# EasyEDA Pro project ProPrj_T113最小系统(最简)_2026-08-06.epro, board PCB1
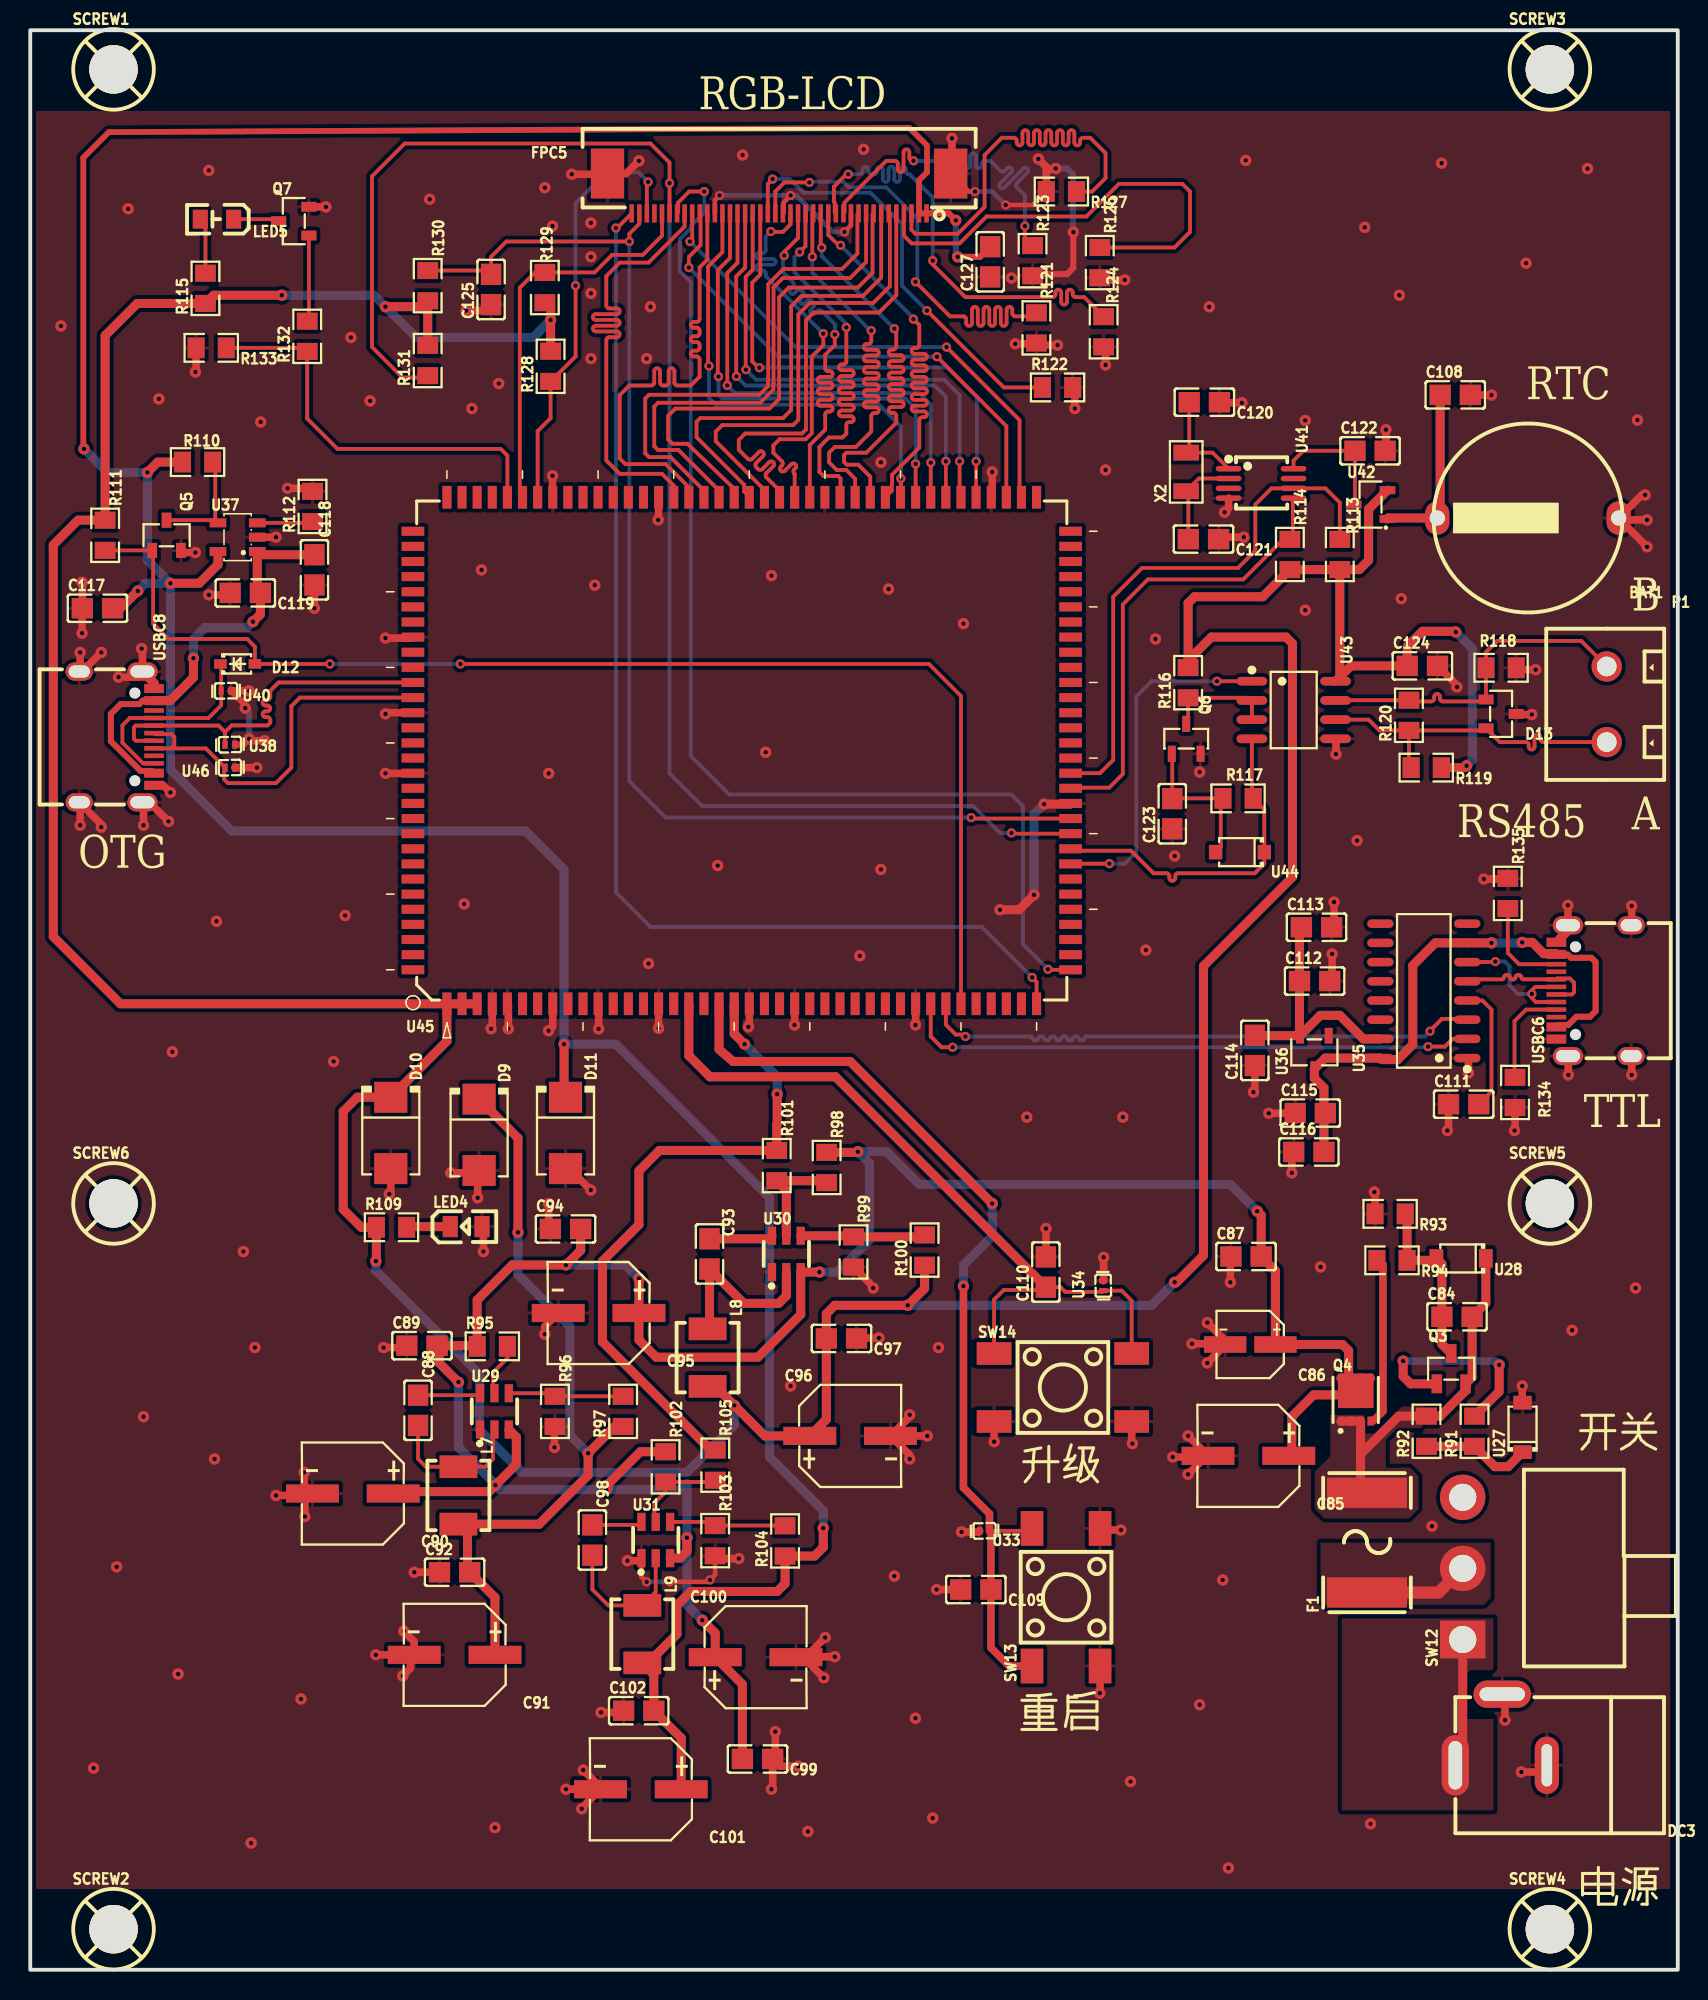
[diagram p3: board, top side]
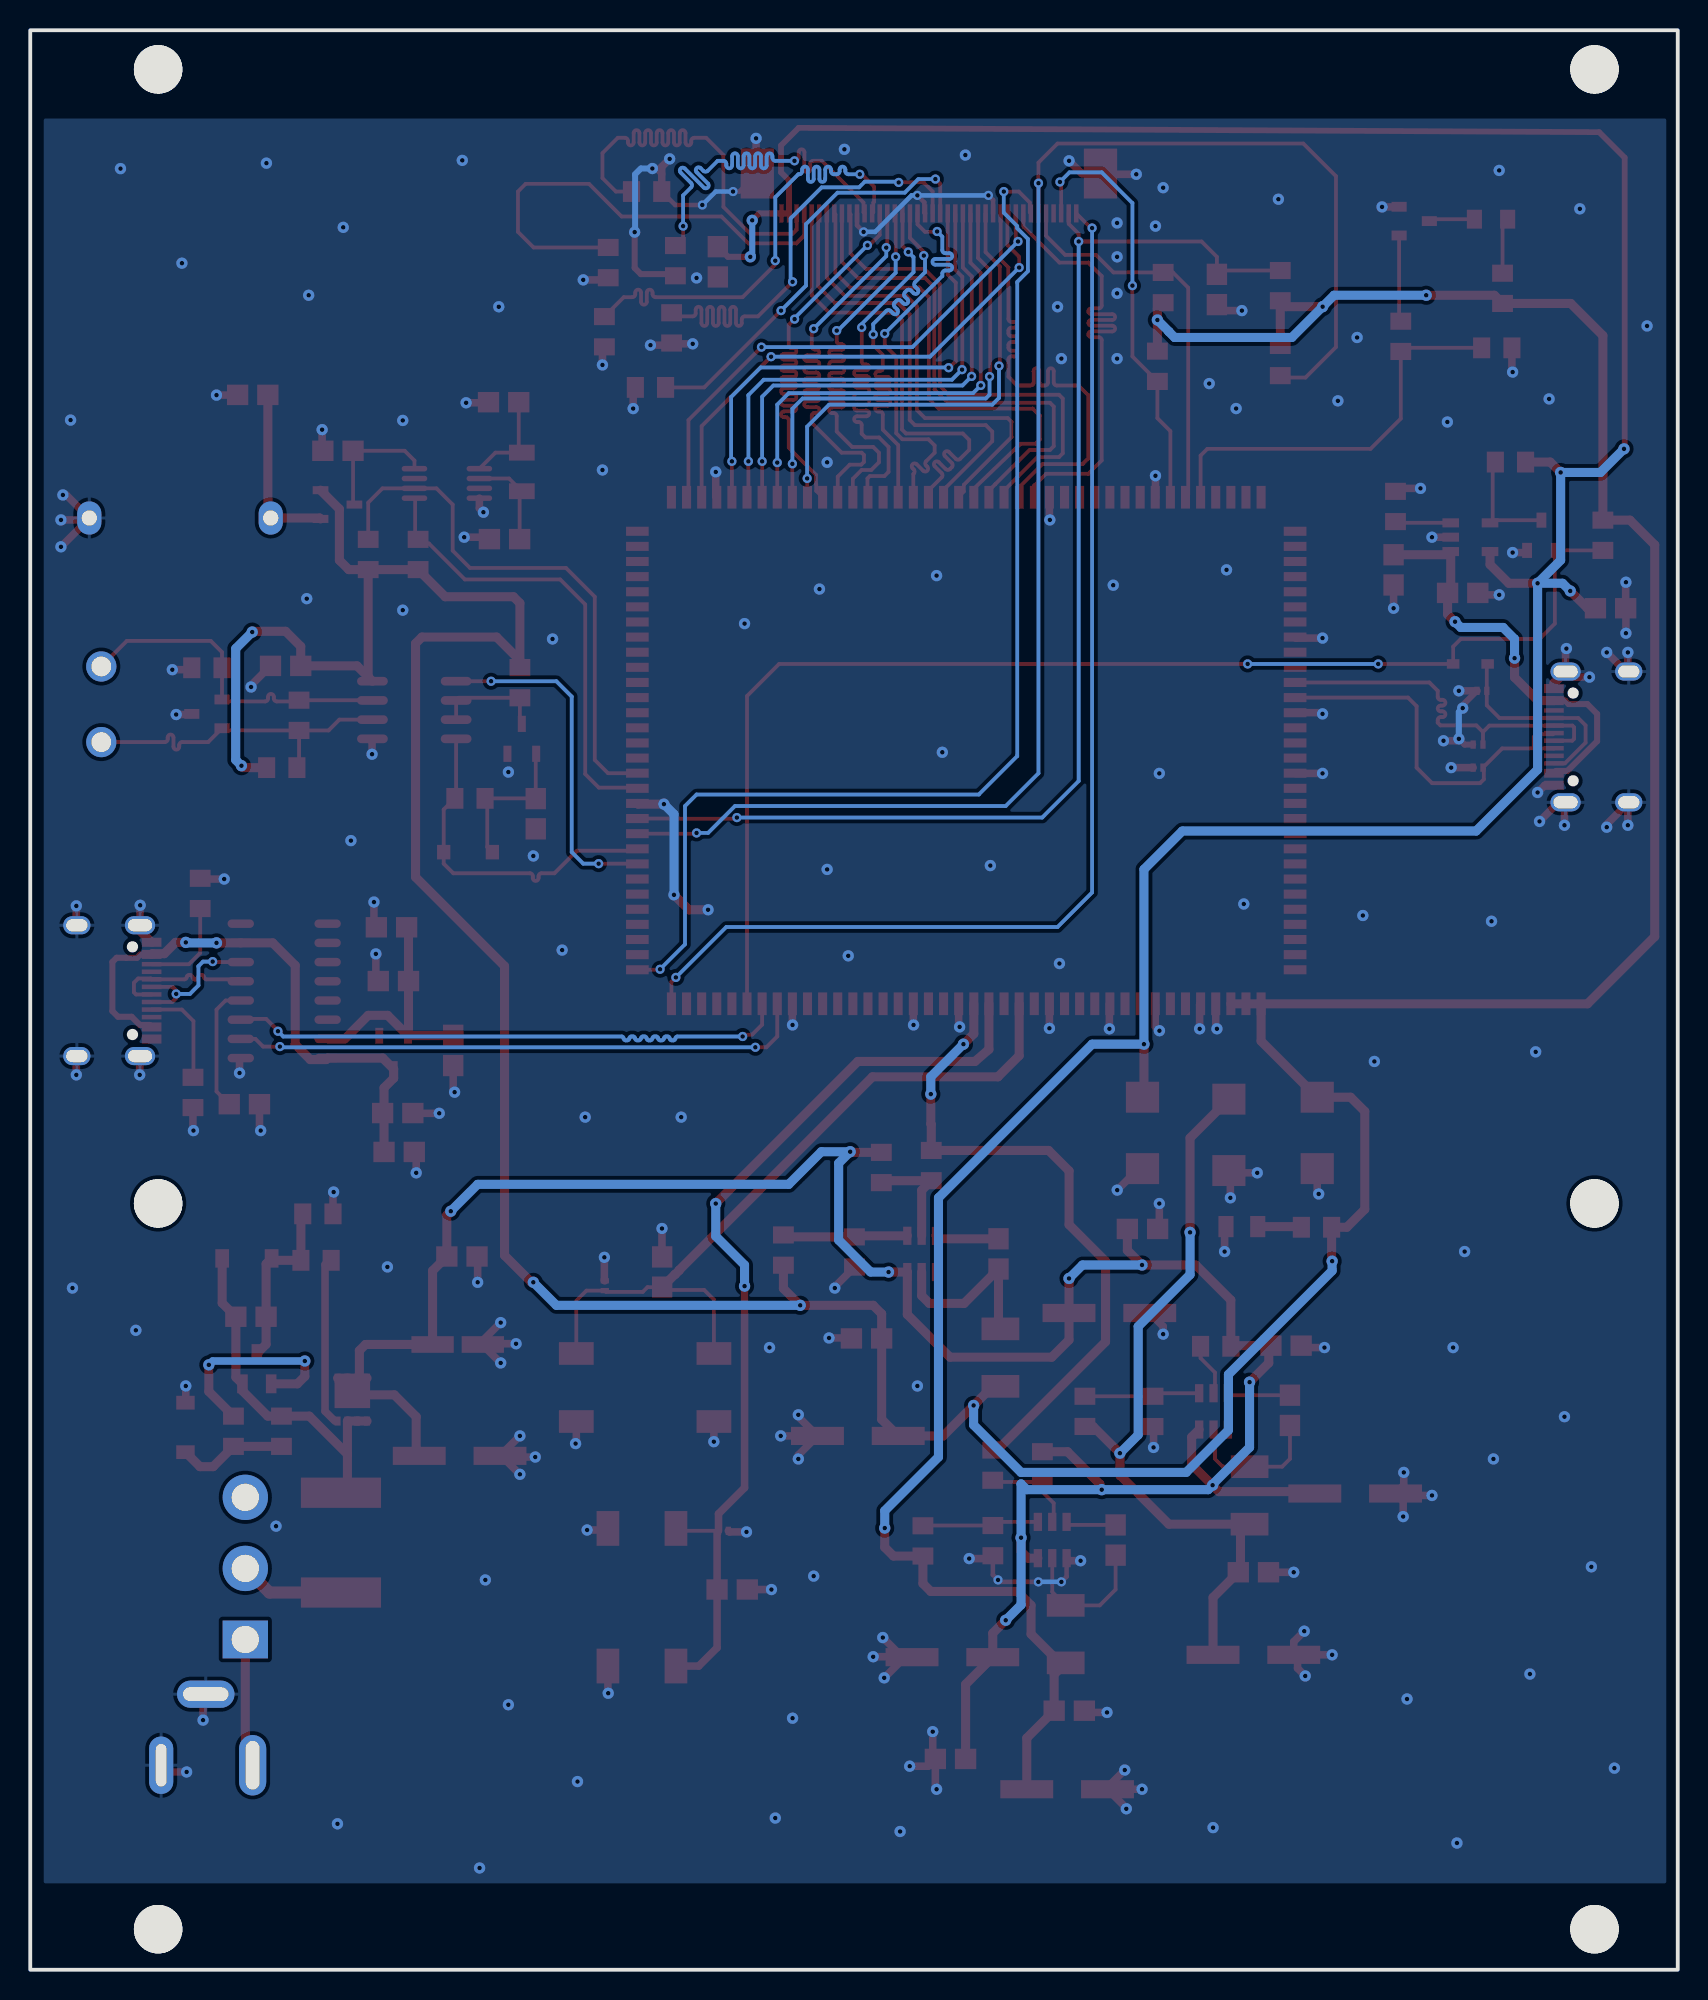
[diagram p4: board, bottom side, seen from below]

Outline 108.97 x 128.27 mm; copper layers: Top Layer, Bottom Layer. Coordinates in mm from the lower left corner of the outline.
Outline path: rectangle 0,128.27 108.97,0
Stack: Top Layer 0.035mm / Dielectric1 1.51mm FR4 er 4.5 / Bottom Layer 0.035mm

## Design rules (mm)
net RS485_1_B: DP4
net RS485_1_A: DP4
net UART4_TX: DP5
net UART0_RX: DP3
net UART0_TX: DP3
net CH343_D+: DP2
net CH343_D-: DP2
net USB0_N: DP1
net USB0_P: DP1
net UART4_RX: DP5
template: 自定义配置
spacing copperThickness1oz (default): track to track 0.102, other pairs 0.152 to 0.3
spacing copperThickness2oz: track to track 0.203, other pairs 0.152 to 0.3
track width copperThickness1oz (default): min 0.127, default 0.3, max 2.54
track width copperThickness2oz: min 0.203, default 0.254, max 2.54
differential pair differentialPair (default): width min 0.127, default 0.254, max 2.54; gap min 0.152, default 0.152
via viaSize (default): diameter min 0.5, default 0.61, max 10; hole min 0.3, default 0.305, max 6.3

## Placement (name value [footprint] x y rotation side)
BAT1  CR1220  [TH_BD12.5-P12.0-RD-CR1220]  99.06 96.01 180 top
C84  1uF  [C0805]  94.37 43.19 0 top
C85  120uF  [CAP-SMD_BD6.3-L6.6-W6.6-FD]  80.57 33.99 180 top
C86  10uF  [CAP-SMD_BD4.0-L4.3-W4.3-LS5.0-FD]  80.69 41.35 180 top
C87  100nF  [C0805]  80.41 47.17 0 top
C88  100nF  [C0805]  25.65 37 270 top
C89  100nF  [C0805]  25.91 41.27 0 top
C90  47uF  [CAP-SMD_BD6.3-L6.6-W6.6-LS7.2-FD]  21.34 31.5 180 top
C91  120uF  [CAP-SMD_BD6.3-L6.6-W6.6-FD]  28.07 20.83 180 top
C92  100nF  [C0805]  28.07 26.29 0 top
C93  100nF  [C0805]  44.93 47.34 270 top
C94  100nF  [C0805]  35.4 48.99 0 top
C95  47uF  [CAP-SMD_BD6.3-L6.6-W6.6-LS7.2-FD]  37.59 43.43 180 top
C96  120uF  [CAP-SMD_BD6.3-L6.6-W6.6-FD]  54.23 35.31 0 top
C97  100nF  [C0805]  53.65 41.75 180 top
C98  100nF  [C0805]  37.18 28.42 270 top
C99  100nF  [C0805]  48.1 13.94 180 top
C100  47uF  [CAP-SMD_BD6.3-L6.6-W6.6-LS7.2-FD]  47.98 20.67 0 top
C101  120uF  [CAP-SMD_BD6.3-L6.6-W6.6-FD]  40.39 11.94 180 top
C102  100nF  [C0805]  40.24 17.13 0 top
C108  100nF  [C0805]  94.25 104.16 0 top
C109  100nF  [C0805]  62.54 25.15 180 top
C110  100nF  [C0805]  67.17 46.14 90 top
C111  100nF  [C0805]  94.8 57.24 0 top
C112  10uF  [C0805]  84.95 65.39 0 top
C113  100nF  [C0805]  85.07 68.94 0 top
C114  1uF  [C0805]  80.99 60.8 90 top
C115  100nF  [C0805]  84.66 56.66 0 top
C116  10uF  [C0805]  84.57 54.09 0 top
C117  100nF  [C0805]  4.44 90.04 0 top
C118  100nF  [C0805]  18.8 92.58 270 top
C119  10uF  [C0805]  14.22 91.06 180 top
C120  6pF  [C0805]  77.66 103.67 180 top
C121  6pF  [C0805]  77.6 94.61 180 top
C122  100nF  [C0805]  88.61 100.46 0 top
C123  1nF  [C0805]  75.53 76.45 90 top
C124  100nF  [C0805]  92.08 86.23 0 top
C125  10nF  [C0805]  30.48 111.12 90 top
C127  100nF  [C0805]  63.49 112.96 90 top
D9  SMBJ3.3A  [SMB_L4.6-W3.6-LS5.3-RD]  29.69 55.22 270 top
D10  SMBJ3.3A  [SMB_L4.6-W3.6-LS5.3-RD]  23.85 55.34 270 top
D11  SMBJ5.0A  [SMB_L4.6-W3.6-LS5.3-RD]  35.4 55.34 270 top
D12  BAT54WS  [SOD-323_L1.7-W1.3-LS2.6-RD-1]  13.72 86.36 0 top
D13  SM712  [SOT-23-3_L2.9-W1.3-P1.90-LS2.4-BR]  97.28 83.06 180 top
DC3  JPD1030-N521-4F  [DC-IN-TH_JPD1030-N521-4F]  97.28 15.88 180 top
F1  JK-SMD200L-24V  [F2920]  88.41 28.25 90 top
FPC5  AFC07-S40ECA-00  [FPC-SMD_P0.50-40P_LCS-SJ-H2.0]  49.53 117.47 0 top
L7  4.7uH  [IND-SMD_L4.6-W4.1-A]  28.32 31.37 270 top
L8  4.7uH  [IND-SMD_L4.6-W4.1-A]  44.8 40.48 270 top
L9  4.7uH  [IND-SMD_L4.6-W4.1-A]  40.48 22.2 270 top
LED4  KT-0805G  [LED0805-R-RD]  28.83 49.15 0 top
LED5  LTST-C170TBKT  [LED0805-RD_BLUE]  12.35 115.77 180 top
P1  WJ126V-5.0-2P  [CONN-TH_WJ126V-5.0-2P]  104.27 83.69 180 top
Q3  MMBTA56  [SOT-23-3_L2.9-W1.3-P1.90-LS2.4-BL-1]  93.98 39.75 0 top
Q4  HSBB4115  [DFN-8_L3.0-W3.0-P0.65-BL-1]  87.66 37.71 0 top
Q5  SI2302  [SOT-23-3_L2.9-W1.3-P1.90-LS2.4-BR]  9.02 94.87 270 top
Q6  S8050  [SOT-23-3_L2.9-W1.3-P1.90-LS2.3-BR]  76.45 81.41 270 top
Q7  S8050  [SOT-23-3_L2.9-W1.3-P1.90-LS2.4-BR]  17.43 115.65 0 top
R91  1kΩ  [R0805]  95.53 35.61 90 top
R92  100kΩ  [R0805]  92.35 35.61 90 top
R93  100kΩ  [R0805]  89.94 49.99 180 top
R94  10kΩ  [R0805]  90.06 46.92 180 top
R95  100kΩ  [R0805]  30.56 41.23 0 top
R96  10kΩ  [R0805]  34.7 36.93 270 top
R97  31.6kΩ  [R0805]  39.21 36.93 90 top
R98  100kΩ  [R0805]  52.67 53.06 270 top
R99  10kΩ  [R0805]  54.45 47.47 270 top
R100  31.6kΩ  [R0805]  59.15 47.6 90 top
R101  100kΩ  [R0805]  49.37 53.18 270 top
R102  100kΩ  [R0805]  42.02 33.26 270 top
R103  10kΩ  [R0805]  45.3 28.38 270 top
R104  52.3kΩ  [R0805]  49.92 28.36 90 top
R105  100kΩ  [R0805]  45.31 33.37 270 top
R109  510Ω  [R0805]  23.89 49.1 0 top
R110  10kΩ  [R0805]  11.06 99.71 180 top
R111  49.9kΩ  [R0805]  4.95 94.87 270 top
R112  5.1kΩ  [R0805]  18.67 96.77 90 top
R113  10kΩ  [R0805]  86.61 93.6 270 top
R114  10kΩ  [R0805]  83.31 93.6 270 top
R115  510Ω  [R0805]  11.59 111.2 90 top
R116  10kΩ  [R0805]  76.58 85.12 90 top
R117  15kΩ  [R0805]  79.88 77.47 180 top
R118  360Ω  [R0805]  97.28 86.11 0 top
R119  360Ω  [R0805]  92.33 79.5 180 top
R120  120Ω  [R0805]  91.19 82.96 90 top
R121  47kΩ  [R0805]  66.55 108.58 270 top
R122  47kΩ  [R0805]  67.95 104.65 0 top
R123  47kΩ  [R0805]  66.29 113.03 270 top
R124  47kΩ  [R0805]  70.99 108.33 270 top
R126  47kΩ  [R0805]  70.74 112.9 270 top
R127  47kΩ  [R0805]  68.2 117.6 180 top
R128  2.2kΩ  [R0805]  34.42 106.04 90 top
R129  2.2kΩ  [R0805]  34.04 111.25 270 top
R130  10kΩ  [R0805]  26.29 111.38 270 top
R131  10kΩ  [R0805]  26.29 106.43 90 top
R132  10kΩ  [R0805]  18.32 108.03 90 top
R133  51kΩ  [R0805]  11.97 107.26 180 top
R134  5.1kΩ  [R0805]  98.2 58.02 90 top
R135  5.1kΩ  [R0805]  97.73 71.18 270 top
SCREW1  -  [M3螺丝]  5.51 125.68 0 top
SCREW2  -  [M3螺丝]  5.51 2.68 0 top
SCREW3  -  [M3螺丝]  100.51 125.68 0 top
SCREW4  -  [M3螺丝]  100.51 2.68 0 top
SCREW5  -  [M3螺丝]  100.51 50.68 0 top
SCREW6  -  [M3螺丝]  5.51 50.68 0 top
SW12  SS-12D06L5  [SW-TH_3P-P4.70_L11.1-W12.7]  94.74 26.54 90 top
SW13  KH-6X6X5H-STM  [SW-SMD_4P-L6.0-W6.0-P4.50-LS9.0_H5.0]  68.51 24.64 90 top
SW14  KH-6X6X5H-STM  [SW-SMD_4P-L6.0-W6.0-P4.50-LS9.0_H5.0]  68.3 38.51 0 top
U27  BZT52B13  [SOD-123_L2.7-W1.6-LS3.7-RD]  98.7 35.87 90 top
U28  BZT52B10  [SOD-123_L2.7-W1.6-LS3.7-RD]  94.64 47.04 180 top
U29  SCT2230CTVBR  [TSOT-23-6_L2.9-W1.6-P0.95-LS2.8-BL]  30.7 36.93 0 top
U30  SCT2230CTVBR  [TSOT-23-6_L2.9-W1.6-P0.95-LS2.8-BL]  50.01 47.34 0 top
U31  SCT2230CTVBR  [TSOT-23-6_L2.9-W1.6-P0.95-LS2.8-BL]  41.37 28.42 0 top
U33  ESD5451N  [X1-DFN1006-2_L1.0-W0.6-P0.65-BI]  63.12 29.03 180 top
U34  ESD5451N  [X1-DFN1006-2_L1.0-W0.6-P0.65-BI]  70.97 45.24 90 top
U35  CH343G  [SOP-16_L10.0-W3.9-P1.27-LS6.0-BL]  92.17 64.74 90 top
U36  XC6206P332MR  [SOT-23-3_L3.0-W1.7-P0.95-LS2.9-BR]  84.93 60.67 90 top
U37  MT9700  [SOT-23-5_L3.0-W1.7-P0.95-LS2.8-BR]  13.72 94.74 0 top
U38  ESD5451N  [X1-DFN1006-2_L1.0-W0.6-P0.65-BI]  13.21 81.03 0 top
U40  ESD5451N  [X1-DFN1006-2_L1.0-W0.6-P0.65-BI]  12.95 84.58 180 top
U41  AT8563S  [MSOP-8_L3.0-W3.0-P0.65-LS5.0-BL]  81.41 98.3 270 top
U42  BAT54C  [SOT-23-3_L2.9-W1.3-P1.90-LS2.8-BR]  88.65 96.9 0 top
U43  SP3485EEN(UMW)  [SOP-8_L5.0-W4.0-P1.27-LS6.0-BL]  83.57 83.31 270 top
U44  MBR0520  [SOD-123_L2.7-W1.6-LS3.7-RD-A]  80.01 73.91 180 top
U45  ATK_CLT113i-S  [ATK-DLT113IS:ATK_CLT113i_CORE]  27.56 64.13 0 top
U46  ESD5451N  [X1-DFN1006-2_L1.0-W0.6-P0.65-BI]  13.21 79.5 0 top
USBC6  TYPE-C-31-M-12  [USB-C_SMD-TYPE-C-31-M-12_1]  103.41 64.75 90 top
USBC8  TYPE-C-31-M-12  [USB-C_SMD-TYPE-C-31-M-12_1]  5.71 81.53 270 top
X2  32.768kHz  [CRYSTAL-SMD_L3.2-W1.5-1]  76.45 99.06 90 top

## Footprints (pads in the part's own frame, mm; a bottom-side part is the same pattern mirrored in y, then rotated)
ATK-DLT113IS:ATK_CLT113i_CORE
  rect 0.6x1.5 smd: 1(0,-0.25) 2(1,-0.25) 3(2,-0.25) 4(3,-0.25) 5(4,-0.25) 6(5,-0.25) 7(6,-0.25) 8(7,-0.25) 9(8,-0.25) 10(9,-0.25) 11(10,-0.25) 12(11,-0.25) 13(12,-0.25) 14(13,-0.25) 15(14,-0.25) 16(15,-0.25) 17(16,-0.25) 18(17,-0.25) 19(18,-0.25) 20(19,-0.25) 21(20,-0.25) 22(21,-0.25) 23(22,-0.25) 24(23,-0.25) 25(24,-0.25) 26(25,-0.25) 27(26,-0.25) 28(27,-0.25) 29(28,-0.25) 30(29,-0.25) 31(30,-0.25) 32(31,-0.25) 33(32,-0.25) 34(33,-0.25) 35(34,-0.25) 36(35,-0.25) 37(36,-0.25) 38(37,-0.25) 39(38,-0.25) 40(39,-0.25) 71(39,33.25) 72(38,33.25) 73(37,33.25) 74(36,33.25) 75(35,33.25) 76(34,33.25) 77(33,33.25) 78(32,33.25) 79(31,33.25) 80(30,33.25) 81(29,33.25) 82(28,33.25) 83(27,33.25) 84(26,33.25) 85(25,33.25) 86(24,33.25) 87(23,33.25) 88(22,33.25) 89(21,33.25) 90(20,33.25) 91(19,33.25) 92(18,33.25) 93(17,33.25) 94(16,33.25) 95(15,33.25) 96(14,33.25) 97(13,33.25) 98(12,33.25) 99(11,33.25) 100(10,33.25) 101(9,33.25) 102(8,33.25) 103(7,33.25) 104(6,33.25) 105(5,33.25) 106(4,33.25) 107(3,33.25) 108(2,33.25) 109(1,33.25) 110(0,33.25)
  rect 1.5x0.6 smd: 41(41.25,2) 42(41.25,3) 43(41.25,4) 44(41.25,5) 45(41.25,6) 46(41.25,7) 47(41.25,8) 48(41.25,9) 49(41.25,10) 50(41.25,11) 51(41.25,12) 52(41.25,13) 53(41.25,14) 54(41.25,15) 55(41.25,16) 56(41.25,17) 57(41.25,18) 58(41.25,19) 59(41.25,20) 60(41.25,21) 61(41.25,22) 62(41.25,23) 63(41.25,24) 64(41.25,25) 65(41.25,26) 66(41.25,27) 67(41.25,28) 68(41.25,29) 69(41.25,30) 70(41.25,31) 111(-2.25,31) 112(-2.25,30) 113(-2.25,29) 114(-2.25,28) 115(-2.25,27) 116(-2.25,26) 117(-2.25,25) 118(-2.25,24) 119(-2.25,23) 120(-2.25,22) 121(-2.25,21) 122(-2.25,20) 123(-2.25,19) 124(-2.25,18) 125(-2.25,17) 126(-2.25,16) 127(-2.25,15) 128(-2.25,14) 129(-2.25,13) 130(-2.25,12) 131(-2.25,11) 132(-2.25,10) 133(-2.25,9) 134(-2.25,8) 135(-2.25,7) 136(-2.25,6) 137(-2.25,5) 138(-2.25,4) 139(-2.25,3) 140(-2.25,2)
C0805
  rect 1.41x1.35 smd: 1(-1,0) 2(1,0)
CAP-SMD_BD4.0-L4.3-W4.3-LS5.0-FD
  rect 2.8x1.1 smd: 1(-1.661,0) 2(1.661,0)
CAP-SMD_BD6.3-L6.6-W6.6-FD
  rect 3.5x1.2 smd: 1(-2.67,0) 2(2.67,0)
CAP-SMD_BD6.3-L6.6-W6.6-LS7.2-FD
  rect 3.5x1.2 smd: 1(-2.67,0) 2(2.67,0)
CONN-TH_WJ126V-5.0-2P
  round 2 hole 1.3: 1(0,2.501) 2(0,-2.501)
CRYSTAL-SMD_L3.2-W1.5-1
  rect 1.05x1.7 smd: 1(-1.275,0) 2(1.275,0)
DC-IN-TH_JPD1030-N521-4F
  oval 1.8x4 hole 0.9x3.2: 1(3.025,2.35)
  oval 1.6x3.8 hole 0.7x2.8: 2(-3.025,2.35)
  oval 3.8x1.8 hole 3x0.9: 3(-0.075,-2.35)
DFN-8_L3.0-W3.0-P0.65-BL-1
  rect 0.4x0.6 smd: 1(-0.975,-1.419) 2(-0.325,-1.419) 3(0.325,-1.419) 4(0.975,-1.419) 5(-0.975,1.419) 5(-0.325,1.419) 5(0.325,1.419) 5(0.975,1.419)
  rect 2.35x1.75 smd: 5(0,0.315)
F2920
  rect 2x5.3 smd: 1(-3.3,0) 2(3.3,0)
FPC-SMD_P0.50-40P_LCS-SJ-H2.0
  rect 0.3x1.2 smd: 1(9.751,-1.318) 2(9.252,-1.318) 3(8.753,-1.318) 4(8.252,-1.318) 5(7.752,-1.318) 6(7.252,-1.318) 7(6.752,-1.318) 8(6.251,-1.318) 9(5.753,-1.318) 10(5.253,-1.318) 11(4.753,-1.318) 12(4.252,-1.318) 13(3.752,-1.318) 14(3.251,-1.318) 15(2.752,-1.318) 16(2.253,-1.318) 17(1.752,-1.318) 18(1.252,-1.318) 19(0.752,-1.318) 20(0.252,-1.318) 21(-0.249,-1.318) 22(-0.748,-1.318) 23(-1.247,-1.318) 24(-1.748,-1.318) 25(-2.248,-1.318) 26(-2.748,-1.318) 27(-3.248,-1.318) 28(-3.749,-1.318) 29(-4.247,-1.318) 30(-4.747,-1.318) 31(-5.247,-1.318) 32(-5.748,-1.318) 33(-6.248,-1.318) 34(-6.749,-1.318) 35(-7.248,-1.318) 36(-7.747,-1.318) 37(-8.248,-1.318) 38(-8.748,-1.318) 39(-9.248,-1.318) 40(-9.748,-1.318)
  rect 2.2x3.3 smd: 41(11.35,1.318) 42(-11.35,1.318)
IND-SMD_L4.6-W4.1-A
  rect 1.5x2.5 smd: 1(-1.9,0) 2(1.9,0)
LED0805-R-RD
  rect 1x1.399 smd: 1(1.05,0) 2(-1.05,0)
LED0805-RD_BLUE
  rect 1x1.25 smd: 1(-1.1,0) 2(1.1,0)
M3螺丝
  round 3.2 hole 3.2: 1(0,0)
MSOP-8_L3.0-W3.0-P0.65-LS5.0-BL
  oval 0.364x1.692 smd: 1(-0.975,-2.146) 2(-0.325,-2.146) 3(0.325,-2.146) 4(0.975,-2.146) 5(0.975,2.146) 6(0.325,2.146) 7(-0.325,2.146) 8(-0.975,2.146)
R0805
  rect 1.133x1.377 smd: 1(-1,0) 2(1,0)
SMB_L4.6-W3.6-LS5.3-RD
  rect 2.047x2.192 smd: 1(-2.361,0) 2(2.361,0)
SOD-123_L2.7-W1.6-LS3.7-RD
  rect 0.91x1.22 smd: 1(-1.635,0) 2(1.635,0)
SOD-123_L2.7-W1.6-LS3.7-RD-A
  rect 0.88x0.96 smd: 1(-1.61,0) 2(1.61,0)
SOD-323_L1.7-W1.3-LS2.6-RD-1
  rect 0.83x0.63 smd: 1(-1.14,0) 2(1.14,0)
SOP-8_L5.0-W4.0-P1.27-LS6.0-BL
  oval 0.574x2.035 smd: 1(-1.905,-2.768) 2(-0.635,-2.768) 3(0.635,-2.768) 4(1.905,-2.768) 5(1.905,2.768) 6(0.635,2.768) 7(-0.635,2.768) 8(-1.905,2.768)
SOP-16_L10.0-W3.9-P1.27-LS6.0-BL
  oval 0.56x1.745 smd: 1(-4.445,-2.873) 2(-3.175,-2.873) 3(-1.905,-2.873) 4(-0.635,-2.873) 5(0.635,-2.873) 6(1.905,-2.873) 7(3.175,-2.873) 8(4.445,-2.873) 9(4.445,2.873) 10(3.175,2.873) 11(1.905,2.873) 12(0.635,2.873) 13(-0.635,2.873) 14(-1.905,2.873) 15(-3.175,2.873) 16(-4.445,2.873)
SOT-23-3_L2.9-W1.3-P1.90-LS2.3-BR
  rect 1.07x0.532 smd: 1(0.99,-0.95) 2(0.99,0.95) 3(-0.99,0)
SOT-23-3_L2.9-W1.3-P1.90-LS2.4-BL-1
  rect 0.7x1.25 smd: 1(-0.95,-1) 2(0.95,-1) 3(0,1)
SOT-23-3_L2.9-W1.3-P1.90-LS2.4-BR
  rect 1x0.65 smd: 1(1,-0.95) 2(1,0.95) 3(-1,0)
SOT-23-3_L2.9-W1.3-P1.90-LS2.8-BR
  rect 1.04x0.532 smd: 1(1.12,-0.95) 2(1.12,0.95) 3(-1.12,0)
SOT-23-3_L3.0-W1.7-P0.95-LS2.9-BR
  rect 1.038x0.532 smd: 1(1.101,-0.95) 2(1.101,0.95) 3(-1.101,0)
SOT-23-5_L3.0-W1.7-P0.95-LS2.8-BR
  rect 1.1x0.6 smd: 1(1.3,-0.95) 2(1.3,0) 3(1.3,0.95) 4(-1.3,0.95) 5(-1.3,-0.95)
SW-SMD_4P-L6.0-W6.0-P4.50-LS9.0_H5.0
  rect 2.3x1.5 smd: 1(-4.55,2.25) 2(4.55,2.25) 3(-4.55,-2.25) 4(4.55,-2.25)
SW-TH_3P-P4.70_L11.1-W12.7
  rect 2.5x3 hole 1.8: 1(-4.7,0)
  round 3 hole 1.8: 2(0,0) 3(4.7,0)
TH_BD12.5-P12.0-RD-CR1220
  oval 1.6x2.2 hole 1: 1(-6,0) 2(6,0)
TSOT-23-6_L2.9-W1.6-P0.95-LS2.8-BL
  rect 0.55x1.2 smd: 1(-0.95,-1.2) 2(0,-1.2) 3(0.95,-1.2) 4(0.95,1.2) 5(0,1.2) 6(-0.95,1.2)
USB-C_SMD-TYPE-C-31-M-12_1
  oval 1.2x2 hole 0.8x1.6: 1(4.325,1.706) 4(-4.325,1.706)
  oval 1.2x1.8 hole 0.8x1.4: 2(4.325,-2.474) 3(-4.325,-2.474)
  custom 0.6x1.3 smd: A1B12(-3.2,2.474) A4B9(-2.4,2.474) B1A12(3.2,2.474) B4A9(2.401,2.474)
  rect 0.3x1.3 smd: A5(-1.25,2.474) A6(-0.25,2.474) A7(0.25,2.474) A8(1.25,2.474) B5(1.75,2.474) B6(0.75,2.474) B7(-0.75,2.474) B8(-1.75,2.474)
X1-DFN1006-2_L1.0-W0.6-P0.65-BI
  rect 0.35x0.55 smd: 1(-0.325,0) 2(0.325,0)

## Nets
As in the schematic.

Pads without a net: FPC5 37; SCREW1 1; SCREW2 1; SCREW3 1; SCREW4 1; SCREW5 1; SCREW6 1; SW12 3; U35 8 9 10 11 12 13 14; U41 3 7; U45 6 7 9 10 12 13 14 16 18 22 23 25 26 27 28 29 30 31 36 37 38 39 42 43 44 45 46 47 55 56 57 58 59 60 61 62 63 64 65 66 67 68 69 70 71 97 98 99 100 101 102 107 108 109 110 111 112 113 114 115 116 117 119 120 124 125 126 128 129 130 131 132 133 134 135 136 137 138 139 140; USBC6 A8 B8; USBC8 A8 B8

## Via types
v1: diameter 0.75, hole 0.305, Top Layer to Bottom Layer, 250 vias
v2: diameter 0.61, hole 0.305, Top Layer to Bottom Layer, 64 vias

## Routing (per net, layer and track width the routed paths; a pad name or vN(x,y) marks a point on that pad's centre or on a via; arc(x,y) is an arc through that point)
GND: length 264
  Top Layer w0.3: R103.2 45.3,26.12 v2(44.96,25.78) 44.83,25.65 v2(42.29,25.65) ; U31.1 40.42,26 v2(40.77,25.65) ; 45.28,116.16 45.28,117.04 v2(45.59,117.35) ; FPC5.11 54.28,115.37 v2(53.85,114.93) ; R127.2 66.31,116.71 v2(64.52,116.71) ; v2(50.29,117.35) 50.29,117.34 49.83,116.88 49.83,116.21 FPC5.20 ; v2(62.48,117.6) 62.07,117.6 FPC5.41
  Top Layer w0.4: v1(14.22,83.44) 14.22,83.64 U40.1 ; v1(68.99,114.92) 68.99,112.55 68.58,112.14 66.79,112.14 66.67,112.03 R123.2 ; 67.2,118.76 67.56,119.13 v1(67.82,119.13) ; v1(14.48,81.41) 14.1,81.03 U38.2
  Top Layer w0.5: v1(105.92,70.36) 105.92,69.11 USBC6.2 ; v1(93.73,55.5) 93.8,55.58 C111.1 ; v1(63.63,99.06) 63.63,97.45 U45.74 ; v1(49.02,11.94) 49.1,12.02 C99.1 ; C99.1 49.58,13.46 v1(50.8,13.46) ; C99.1 49.28,14.12 v1(49.28,15.75) ; v1(5.84,85.49) 7.05,85.49 USBC8.4 7.42,87.32 v1(7.37,87.38) ; 51.31,20.7 50.67,20.7 50.64,20.67 ; 51.31,20.7 v1(52.58,21.97) ; 51.31,20.7 51.28,20.67 51.12,20.67 v1(52.49,19.31) ; 51.31,20.7 v1(53.21,20.7) ; v1(80.14,103.63) 78.69,103.63 C120.1 ; USBC6.3 105.92,60.39 v1(105.92,59.18) ; v1(76.58,35.31) 77.9,33.99 C85.2 ; D10.2 23.85,51.4 v1(23.75,51.31) ; v1(34.28,62.1) 34.56,62.38 U45.8 ; U45.123 23.57,83.13 v1(23.49,83.06) ; v1(69.09,103.25) 69.09,104.5 R122.2 ; C108.2 95.27,104.14 v1(96.65,104.14) ; v1(79.37,45.47) 79.37,47.13 C87.1 ; v1(4.7,87.12) 3.44,85.86 USBC8.3 3.3,85.92 v1(3.3,87.12) ; v1(24.7,22.39) 25.4,21.7 C91.2 25.15,20.83 ; v1(80.9,58.04) 80.99,58.13 C114.1 ; R103.2 45.49,27.19 v1(46.86,27.19) ; v1(76.58,32.77) 77.72,33.91 v1(75.56,33.91) ; R93.2 88.94,51.39 v1(88.9,51.43) ; v1(34.29,50.67) 34.29,49.11 C94.1 ; v1(106.93,94.11) 105.06,95.98 BAT1.1 ; v1(18.16,29.97) 18.16,30.99 18.54,31.37 ; v1(9.27,77.86) 8.8,78.33 USBC8.B1A12 ; D11.2 35.65,52.98 v1(37.07,51.56) ; v1(41.53,95.88) 41.56,95.91 U45.96 ; v1(101.7,70.4) 101.7,70.39 USBC6.1 ; USBC6.4 101.73,60.4 v1(101.73,59.18) ; v1(37.59,62.23) 37.59,63.85 U45.11 ; v1(65.15,107.53) 66.49,107.53 R121.2 66.69,107.44 v1(67.95,107.44) ; C124.2 94.36,84.95 v1(94.36,84.84) ; SW14.3 63.75,34.93 v1(63.75,34.92) ; C112.2 86.11,65.55 v1(86.11,67.18) ; v1(40.26,119.63) 39.42,118.79 FPC5.42 38.13,118.74 v1(35.81,118.74) ; U31.1 40.25,27.05 v1(39.5,27.05) ; v1(86.36,80.39) 86.36,81.38 U43.5 ; C101.2 36.47,10.7 v1(36.47,10.65) ; C101.2 37.72,12.07 v1(36.58,13.21) ; C101.2 v1(35.43,11.94) ; DC3.2 99.86,13.08 v1(98.62,13.08) ; R112.2 18.47,97.97 v1(17.02,97.97) ; v1(67.18,49.02) 67.18,47.16 C110.2 ; R99.2 55.75,45.17 v1(55.75,45.08) ; C115.1 83.64,56.64 v1(81.92,56.64) ; v1(61.59,28.96) 62.72,28.96 U33.2 ; U45.15 v1(41.56,62.26) ; R118.2 98.41,85.98 v1(99.57,85.98) ; v1(96.14,72.14) 97.68,72.14 R135.1 ; C121.1 78.72,94.74 v1(80.26,94.74) ; v1(72.39,111.76) 70.88,111.76 R126.2 ; v1(72.9,34.8) 72.85,34.85 SW14.4 ; v1(11.81,90.93) 13.09,90.93 C119.2 ; v1(23.49,79.12) 25.3,79.12 U45.127 ; v1(78.99,96.39) 79.26,96.66 U41.4 ; v1(31.62,62.23) 31.62,63.82 U45.5 ; v1(29.97,47.5) 29.97,49.06 LED4.1 ; Q7.2 18.44,116.59 v1(19.56,116.59) ; v1(58.17,36.7) 58.17,36.57 C96.2 ; C109.2 v1(59.94,25.15) ; v1(70.99,47.12) 70.99,45.59 U34.2 ; v1(14.99,79.5) U46.2 ; SW13.3 70.76,18.31 v1(70.74,18.29) ; v1(9.14,75.95) 7.88,77.21 USBC8.1 7.49,77.14 v1(7.49,75.69) ; v1(22.86,20.83) 25.15,20.83 ; 25.15,20.83 25.15,19.94 v1(24.64,19.43) ; C97.1 54.69,41.78 v1(56.13,41.78) ; D9.2 29.59,52.76 v1(29.59,51.05) ; v1(34.04,42.04) 34.04,42.55 C95.2 ; v1(3.3,75.69) 3.3,77.15 4.7,75.75 v1(4.7,75.56) ; v1(83.44,52.7) 83.44,53.96 C116.1 ; v1(97.54,16.51) 97.54,18.05 DC3.3 ; v1(58.17,33.78) 58.17,34.04 C96.2 ; C122.2 89.66,100.5 v1(89.66,101.85) ; v1(37.75,17.02) 39.13,17.02 C102.1 ; 98.7,37.5 98.68,37.52 v1(98.68,38.61) ; v1(98.17,55.5) 98.2,55.53 R134.1 ; 18.54,31.37 C90.2 18.12,32.04 v1(18.12,32.89) ; 18.54,31.37 v1(16.26,31.37) ; v1(3.43,88.39) 3.43,90.03 C117.1 3.44,91.75 v1(3.43,91.76) ; v1(23.37,41.15) 24.78,41.15 C89.1 ; v1(16.26,94.74) U37.2 ; v1(71.12,106.13) 71.12,107.2 R124.2 ; v1(28.83,109.73) 30.08,109.73 C125.1 ; v1(86.23,70.61) 86.23,69.1 C113.2 ; Q5.2 10.11,93.73 v1(10.92,93.73) ; v1(14.48,84.58) U40.1 ; v1(60.96,121.12) 60.96,118.87 FPC5.41 ; R96.2 34.67,35.89 v1(34.67,34.54) ; v1(59.33,35.31) C96.2 ; v1(77.85,42.8) 79.03,41.62 C86.2 ; R133.2 10.97,105.71 v1(10.92,105.66) ; U45.24 50.56,62.5 v1(50.55,62.48) ; R127.2 67.2,119.24 v1(66.67,119.76) ; U45.32 58.56,62.5 v1(58.55,62.48) ; U45.21 47.56,62.42 v1(47.5,62.36) ; v1(15.49,81.28) 14.6,81.28 v1(14.48,81.41) ; D13.3 98.32,83.02 v1(99.31,83.02) ; v1(30.48,62.23) 30.56,62.31 U45.4 ; v1(34.54,98.81) 34.54,97.4 U45.103 ; C118.2 v1(18.8,90.04) ; 29.54,52.7 v1(27.81,52.7) ; U35.1 95.12,60.21 v1(95.12,59.31) ; v1(106.93,95.88) 105.19,95.88 BAT1.1 ; v1(23.49,88.07) 25.24,88.07 U45.118 ; BAT1.1 106.58,97.54 v1(106.81,97.54) ; C86.2 78.98,41.4 v1(76.83,41.4) ; C86.2 79.03,41.31 v1(77.85,40.13) ; C92.1 v1(25.4,26.29) ; SW13.4 70.86,29.08 v1(72.14,29.08)
  Top Layer w0.6: USBC8.4 8.19,85.09 USBC8.A1B12 ; U45.52 68.76,77.09 v1(67.06,77.09) ; v1(64.14,70.1) 65.4,70.1 v1(66.39,71.09) ; USBC6.1 101.7,68.72 USBC6.B1A12
  Bottom Layer w0.3: v2(53.85,114.93) 53.09,114.93 50.67,117.35 v2(50.29,117.35) v2(45.59,117.35) ; v2(40.77,25.65) v2(42.29,25.65) ; v2(64.52,116.71) 63.63,117.6 v2(62.48,117.6)
  Bottom Layer w0.4: v1(14.22,83.44) 14.48,83.18 v1(14.48,81.41) ; v1(68.99,114.92) 68.96,114.95 68.96,118.74 68.58,119.13 v1(67.82,119.13)
  Bottom Layer w0.6: v1(66.39,71.09) 66.39,76.42 v1(67.06,77.09)
  vias: v1(2.03,108.71) v1(4.19,13.33) v1(5.71,26.65) v1(6.48,116.46) v1(7.49,36.58) v1(8.51,103.89) v1(9.4,60.71) v1(9.78,19.56) v1(11.81,119) v1(12.19,33.78) v1(12.32,69.34) v1(14.1,47.5) v1(14.6,8.38) v1(14.86,41.15) v1(15.24,102.36) v1(17.91,17.91) v1(20.07,60.07) v1(20.83,69.72) v1(21.21,107.95) v1(22.48,103.76) v1(26.42,117.09) v1(28.7,70.48) v1(29.21,103.25) v1(29.84,92.58) v1(30.73,9.4) v1(30.99,104.9) v1(34.04,117.86) v1(34.29,79.12) v1(34.54,115.32) v1(37.08,115.52) v1(37.08,113.28) v1(37.08,110.87) v1(37.08,106.55) v1(37.34,91.57) v1(40.77,106.55) v1(40.89,66.55) v1(41.02,109.98) v1(45.47,73.02) v1(47.12,120.01) v1(48.64,80.52) v1(49.02,92.2) v1(50.29,38.61) v1(51.43,9.14) v1(54.86,67.06) v1(55.12,120.4) v1(56.26,99.69) v1(56.26,72.77) v1(56.77,91.31) v1(57.15,26.03) v1(58.55,16.64) v1(59.69,10.03) v1(60.07,41.15) v1(61.72,89.03) v1(64.9,111.89) v1(65.91,56.39) v1(71.12,99.19) v1(72.26,56.39) v1(72.77,12.45) v1(73.79,67.44) v1(74.42,88.01) v1(75.69,73.66) v1(77.34,79.21) v1(77.34,17.53) v1(77.98,109.98) v1(78.87,25.78) v1(79.25,6.73) v1(80.39,119.66) v1(84.33,102.46) v1(84.33,89.92) v1(85.34,46.48) v1(87.76,74.68) v1(88.27,115.23) v1(88.65,9.65) v1(90.55,110.74) v1(90.68,90.68) v1(92.71,29.34) v1(93.34,119.48) v1(98.93,112.86) v1(101.98,42.29) v1(103,119.12) v1(106.17,45.08) v1(106.3,102.49)
VBAT: length 11.5
  Top Layer w0.6: U42.1 89.83,96.01 BAT1.2 93.25,96.2 C108.1
VCC3V3_CORE: length 50.5
  Top Layer w0.6: v1(32.26,48.77) 32.26,55.01 D9.1 ; R97.1 38.66,35.93 v1(36.9,34.16) 36.9,32.71 33.66,29.47 L7.2 28.92,28.87 28.92,26.43 C92.2 30.74,24.62 C91.1
  Bottom Layer w0.6: v1(36.9,34.16) 35.69,35.37 35.69,42.54 32.26,45.97 v1(32.26,48.77)
VCC3V3_SYS: length 318.7
  Top Layer w0.6: R131.2 R130.2 25.9,109.99 v1(23.49,109.99) ; v1(94.28,88.47) 94.23,88.52 92.08,88.52 91.08,87.52 C124.1 87.35,86.23 86.61,85.5 ; v1(22.86,46.86) 22.89,46.9 R109.1 21.89,49.1 20.7,50.29 20.7,56.77 21.64,57.7 D10.1 27.56,61.42 U45.1 ; 86.61,85.5 U43.8 ; 86.61,85.5 R113.2 ; R128.2 v1(34.42,109.11) 34.42,109.87 R129.2 ; R113.2 R114.2 81.52,90.8 77.01,90.8 76.58,90.38 76.58,86.6 ; R113.2 87.9,92.6 88.52,93.22 88.52,96.6 U42.2 ; v1(75.69,45.47) 75.82,45.47 77.6,47.24 77.6,66.38 83.48,72.26 83.48,87.71 83.06,88.14 78.12,88.14 76.58,86.6 ; U45.1 U45.2 U45.3 ; U45.1 5.96,63.88 1.52,68.33 1.52,94.23 3.16,95.87 R111.1 4.95,108.08 7.08,110.2 R115.1 12.13,110.74 v1(16.64,110.74) ; 76.58,86.6 R116.2 ; R119.1 94.87,79.5 v1(95,79.63) ; R100.1 59.15,45.05 v1(58.04,43.94) 53.21,43.94 52.65,43.38 C97.2 52.65,36.4 C96.1 48.59,35.31 v1(46.57,37.32) 45.31,38.58 44.8,38.58
  Bottom Layer w0.6: v1(46.57,37.32) 46.57,36.03 43.43,32.89 32.51,32.89 29.72,35.69 29.72,39.37 22.86,46.23 v1(22.86,46.86) ; v1(58.04,43.94) 74.17,43.94 v1(75.69,45.47) ; v1(95,79.63) 95.38,80.01 95.38,87.38 v1(94.28,88.47) ; v1(16.64,110.74) 22.73,110.74 v1(23.49,109.99) 25.53,107.95 33.27,107.95 33.66,108.33 33.66,108.35 v1(34.42,109.11)
VCC5V_SYS: length 238.2
  Top Layer w0.38: v1(3.56,100.58) 3.51,100.63 3.51,119.84 5.2,121.53 58.14,121.81 59.31,120.65 59.31,118.87 58.78,118.34 FPC5.2
  Top Layer w0.4: C127.2 62.82,113.28 v1(61.34,113.28) ; v1(61.21,115.7) 60.75,116.16 FPC5.1 58.78,116.16
  Top Layer w0.6: R110.2 8.43,99.71 v1(7.75,99.02) ; v1(9.27,91.69) 11.18,91.69 12.42,92.93 U37.5 ; v1(52.45,29.21) 52.45,27.94 51.87,27.36 R104.1 49.92,25.54 49.4,25.02 43.69,25.02 42.77,24.1 42.77,22.2 40.87,20.3 40.48,20.3 41.24,19.53 C102.2 43.06,15.32 C101.1 ; v1(35.31,61.21) 35.31,57.8 D11.1 ; v1(7.11,91.19) 5.97,90.04 C117.2
  Bottom Layer w0.4: v1(61.34,113.28) 61.21,113.41 v1(61.21,115.7)
  Bottom Layer w0.6: v1(9.27,91.69) 7.62,91.69 v1(7.11,91.19) ; v1(9.27,91.69) 7.75,93.22 v1(7.75,99.02) 5.11,99.02 v1(3.56,100.58) ; v1(9.27,91.69) 9.27,79.37 13.33,75.31 32.77,75.31 35.31,72.77 v1(35.31,61.21) 38.73,61.21 48.89,51.05 48.89,33.91 52.45,30.35 v1(52.45,29.21)
VCC12V_DCIN: length 169.2
  Top Layer w0.6: C85.1 83.44,34.19 83.44,36.58 84.88,38.02 Q4.5 ; v1(81.15,50.16) 81.41,49.91 C87.2 82.36,46.23 C86.1 86.79,41.35 87.2,40.95 87.2,39.13 Q4.5 ; R98.1 54.69,54.06 v1(54.74,54.1) ; v1(43.43,28.57) 43.43,27.69 42.97,27.22 42.32,27.22 ; R102.1 40.36,34.26 38.23,32.13 38.23,31.88 v1(38.1,31.75) ; C99.2 47.1,18.88 C100.1 45.31,22.26 v1(44.45,23.11) ; v1(40.26,45.72) C95.1 40.26,41.65 41.4,40.51 48.13,40.51 50.96,43.34 50.96,46.14 v1(52.2,46.14) ; C90.1 24.13,31.62 30.35,31.62 30.76,32.03 v1(30.76,32.04) 32.15,33.43 32.15,35.23 31.65,35.73 ; Q4.5 Q4.5 Q4.5 ; C94.2 36.4,47.58 v1(35.43,46.61) 31.88,46.61 29.56,44.29 R95.1 29.52,41.27 C89.2 27.05,41.13 27.05,40.13 v1(28.32,38.86)
  Bottom Layer w0.6: v1(44.45,23.11) 43.43,24.13 v1(43.43,28.57) 43.43,32.13 43.05,31.75 v1(38.1,31.75) 31.06,31.75 v1(30.76,32.04) 30.76,32.1 28.32,34.54 v1(28.32,38.86) ; v1(81.15,50.16) 79.37,51.94 58.8,51.94 56.64,54.1 v1(54.74,54.1) 55.5,53.34 55.5,48.26 53.38,46.14 v1(52.2,46.14) ; v1(35.43,46.61) 39.37,46.61 v1(40.26,45.72)
VCC_USBOTG: length 27.7
  Top Layer w0.4: USBC8.A4B9 7.45,83.93 7.22,83.71 5.98,83.71 5.33,83.06 5.33,81.25 7.3,79.28 8.04,79.28 USBC8.B4A9
  Top Layer w0.6: USBC8.A4B9 9.26,83.93 10.8,85.47 v1(10.8,86.74) ; v1(14.73,89.15) 15.22,89.65 C119.1 15.02,91.27 U37.1 15.22,93.58 C118.1
  Bottom Layer w0.6: v1(14.73,89.15) 14.35,88.77 11.56,88.77 10.8,88.01 v1(10.8,86.74)
CH343_D+: length 9.8
  Top Layer w0.254: USBC6.A6 101.97,64.5 102.11,64.64 102.11,65.28 101.83,65.56 100.99,65.56 USBC6.B6 98.76,65.5 arc(98.66,65.54) 98.62,65.64 arc(98.58,65.74) 98.48,65.79 98.38,65.79 arc(98.28,65.74) 98.24,65.64 arc(98.2,65.54) 98.1,65.5 98,65.5 arc(97.9,65.54) 97.86,65.64 arc(97.81,65.74) 97.71,65.79 97.62,65.79 arc(97.52,65.74) 97.48,65.64 arc(97.43,65.54) 97.33,65.5 95.17,65.5 U35.5
CH343_D-: length 9.9
  Top Layer w0.254: v2(96.9,66.67) 96.87,66.64 U35.6 ; USBC6.A7 99.55,65 99.31,64.77 99.31,64.26 99.57,64 USBC6.B7
  Bottom Layer w0.254: v2(99.31,64.54) 98.4,64.54 97.84,65.1 97.84,66.37 97.54,66.67 v2(96.9,66.67)
CT_INT: length 83
  Top Layer w0.25: R130.1 30.23,112.38 C125.2 30.48,113.28 31.5,114.3 v2(39.62,114.3) 39.62,114.81 40.28,115.47 FPC5.39 ; v2(62.23,76.2) 62.3,76.13 U45.51
  Bottom Layer w0.25: v2(62.23,76.2) 42.04,76.2 39.62,78.61 v2(39.62,114.3)
CT_RST: length 107.5
  Top Layer w0.25: U45.50 64.95,75.13 v2(64.9,75.18) ; R131.1 26.16,105.3 24.62,105.3 22.61,107.31 22.61,118.62 24.77,120.78 41.02,120.78 42.28,119.52 v2(42.28,118.16) FPC5.35
  Bottom Layer w0.25: v2(64.9,75.18) 64.14,75.18 62.36,76.96 44.45,76.96 42.28,79.13 v2(42.28,118.16)
FEL: length 50.3
  Top Layer w0.25: SW14.2 72.85,44.25 72.18,44.91 U34.1 70.88,44.83 68.45,44.83 68.14,45.14 C110.1 66.98,44.96 64.39,44.96 63.75,44.32 SW14.1
  Top Layer w0.6: C110.1 66.33,45.99 66.31,45.99 66.04,46.25 66.04,46.27 53.26,59.05 44.96,59.05 43.56,60.45 U45.17
I2C2-SCL: length 28.5
  Top Layer w0.25: v2(36.07,111.38) 36.07,106.7 R128.1 34.42,102.62 33.56,101.76 U45.104 ; v2(40.86,118.24) 40.78,118.16 FPC5.38
  Bottom Layer w0.25: v2(40.86,118.24) 40.23,118.87 38.1,118.87 36.07,116.84 v2(36.07,111.38)
I2C2-SDA: length 26.2
  Top Layer w0.25: 41.78,116.16 41.78,114.68 40.51,113.41 38.48,113.41 37.32,112.25 R129.1 33.39,112.25 32.38,111.24 32.38,97.56 U45.105
I2C3-SCL: length 36.5
  Top Layer w0.25: R113.1 86.61,97.03 85.67,97.97 U41.6 82.1,97.97 81.03,96.9 81.03,93.85 79.88,92.71 73.53,92.71 71.63,90.8 71.63,80.01 70.75,79.13 U45.54
I2C3-SDA: length 30.7
  Top Layer w0.25: U41.5 83.51,97.28 83.51,94.88 82.95,94.33 82.6,94.33 80.22,91.95 73.91,91.95 72.26,90.3 72.26,79.08 71.36,78.18 68.85,78.18 U45.53
LCD-CLK: length 33.4
  Top Layer w0.25: U45.94 43.56,98.05 42.03,99.58 39.36,99.58 38.99,99.95 38.99,104.14 39.62,104.77 41.08,104.77 arc(41.22,104.83) 41.27,104.97 41.27,105.73 arc(41.46,105.92) 41.65,105.73 41.65,104.97 arc(41.71,104.83) 41.84,104.77 42.03,104.77 arc(42.17,104.83) 42.22,104.97 42.22,105.73 arc(42.41,105.92) 42.61,105.73 42.61,104.97 arc(42.66,104.83) 42.8,104.77 43.69,104.77 44.27,105.36 44.27,106.51 arc(44.21,106.64) 44.08,106.7 43.88,106.7 arc(43.69,106.89) 43.88,107.08 44.08,107.08 arc(44.21,107.13) 44.27,107.27 44.27,107.46 arc(44.21,107.59) 44.08,107.65 43.88,107.65 arc(43.69,107.84) 43.88,108.03 44.08,108.03 arc(44.21,108.09) 44.27,108.22 44.27,108.41 arc(44.21,108.55) 44.08,108.6 43.88,108.6 arc(43.69,108.79) 43.88,108.98 44.08,108.98 arc(44.21,109.04) 44.27,109.17 44.27,112.59 44.78,113.1 FPC5.30
LCD-DATA0: length 34.1
  Top Layer w0.25: FPC5.21 49.28,117.61 49.88,118.2 v2(51.53,118.2) ; v2(58.55,111.63) 60.83,109.35 61.72,109.35 arc(61.85,109.29) 61.91,109.16 61.91,108.9 arc(62.1,108.71) 62.29,108.9 62.29,109.79 arc(62.48,109.98) 62.67,109.79 62.67,108.9 arc(62.86,108.71) 63.05,108.9 63.05,109.79 arc(63.24,109.98) 63.43,109.79 63.43,108.9 arc(63.62,108.71) 63.81,108.9 63.81,109.79 arc(64,109.98) 64.19,109.79 64.19,108.9 arc(64.38,108.71) 64.57,108.9 64.57,109.79 arc(64.76,109.98) 64.95,109.79 64.95,109.54 arc(65.01,109.4) 65.15,109.35 66.31,109.35 R121.1
  Bottom Layer w0.25: v2(51.53,118.2) 51.58,118.26 53.77,118.26 54.14,117.88 56.62,117.88 58.67,115.82 58.67,111.76 v2(58.55,111.63)
LCD-DATA1: length 28.3
  Top Layer w0.25: R122.1 64.39,104.65 v2(59.31,109.73) ; FPC5.22 48.78,118.11 v2(49.1,118.43)
  Bottom Layer w0.25: v2(59.31,109.73) 57.66,111.38 57.66,115.44 55.57,117.53 51.13,117.53 50.23,118.43 v2(49.1,118.43)
LCD-DATA2: length 32.5
  Top Layer w0.25: v2(48.23,105.95) 48.17,105.95 47.75,106.37 47.75,111.58 48.28,112.11 48.28,116.16 ; v2(62.56,99.76) U45.75
  Bottom Layer w0.25: v2(62.56,99.76) 62.61,99.81 62.61,104.01 60.65,105.97 48.25,105.97 v2(48.23,105.95)
LCD-DATA3: length 32.2
  Top Layer w0.25: U45.76 61.47,97.48 v2(61.47,99.76) ; FPC5.24 47.78,112.43 47.32,111.96 47.32,105.84 v2(47.34,105.82)
  Bottom Layer w0.25: v2(61.47,99.76) 61.47,104.14 60.45,105.16 48.01,105.16 v2(47.34,105.82)
LCD-DATA4: length 32.1
  Top Layer w0.25: v2(46.71,105.38) 46.69,105.39 46.69,111.98 47.28,112.57 FPC5.25 ; v2(60.56,99.76) U45.77
  Bottom Layer w0.25: v2(60.56,99.76) 60.56,104.03 59.82,104.77 47.31,104.77 v2(46.71,105.38)
LCD-DATA5: length 31.8
  Top Layer w0.25: FPC5.26 46.78,112.9 46.1,112.21 v2(46.1,104.78) ; v2(59.56,99.68) U45.78
  Bottom Layer w0.25: v2(46.1,104.78) 46.61,104.27 58.8,104.27 59.56,103.51 v2(59.56,99.68)
LCD-DATA6: length 31.6
  Top Layer w0.25: v2(45.52,105.37) 45.47,105.41 45.47,112.4 46.28,113.21 FPC5.27 ; v2(58.56,99.59) U45.79
  Bottom Layer w0.25: v2(45.52,105.37) 45.52,104.16 45.77,103.91 57.88,103.91 58.56,103.24 v2(58.56,99.59)
LCD-DATA7: length 30.8
  Top Layer w0.25: v2(44.89,106.07) 44.83,106.13 44.83,112.65 45.78,113.6 FPC5.28 ; v2(57.58,98.63) 57.58,97.41 U45.80
  Bottom Layer w0.25: v2(44.89,106.07) 44.89,103.95 45.34,103.5 56.13,103.5 57.58,102.06 v2(57.58,98.63)
LCD-DATA8: length 32.3
  Top Layer w0.25: R123.1 65.79,114.54 v2(65.79,115.32) ; FPC5.12 53.86,116.23 53.86,116.87 56.62,119.63 57.19,119.63 arc(57.32,119.58) 57.38,119.44 57.38,119.06 arc(57.57,118.87) 57.76,119.06 57.76,120.21 arc(57.95,120.4) 58.14,120.21 58.14,119.82 arc(58.2,119.69) 58.33,119.63 v2(58.42,119.63)
  Bottom Layer w0.25: v2(58.42,119.63) 59.69,119.63 arc(59.82,119.69) 59.88,119.82 59.88,119.94 arc(60.07,120.13) 60.26,119.94 60.26,119.32 arc(60.45,119.13) 60.64,119.32 60.64,119.94 arc(60.83,120.13) 61.02,119.94 61.02,119.32 arc(61.21,119.13) 61.4,119.32 61.4,119.94 arc(61.59,120.13) 61.78,119.94 61.78,119.32 arc(61.97,119.13) 62.16,119.32 62.16,119.94 arc(62.36,120.13) 62.55,119.94 62.55,119.32 arc(62.74,119.13) 62.93,119.32 62.93,119.44 arc(62.98,119.58) 63.12,119.63 63.5,119.63 64.17,118.96 arc(64.3,118.91) 64.44,118.96 64.62,119.15 arc(64.89,119.15) 64.89,118.88 64.15,118.13 arc(64.15,117.86) 64.42,117.86 65.68,119.13 arc(65.95,119.13) 65.95,118.86 65.25,118.16 arc(65.19,118.02) 65.25,117.89 65.79,117.35 v2(65.79,115.32)
LCD-DATA9: length 33.6
  Top Layer w0.25: v2(54.1,118.74) 53.98,118.74 53.15,117.92 53.15,116.93 53.21,116.87 53.21,116.23 FPC5.13 ; R124.1 69.71,110.62 69.14,110.62 arc(69.01,110.67) 68.95,110.81 68.95,110.93 arc(68.76,111.12) 68.57,110.93 68.57,110.31 arc(68.38,110.12) 68.19,110.31 68.19,110.93 arc(68,111.12) 67.81,110.93 67.81,110.81 arc(67.75,110.67) 67.62,110.62 61.85,110.62 59.69,112.78 v2(59.69,113.03)
  Bottom Layer w0.25: v2(59.69,113.03) 59.69,117.22 58.17,118.74 58.1,118.74 arc(57.97,118.8) 57.91,118.94 57.91,119.06 arc(57.72,119.25) 57.53,119.06 57.53,118.43 arc(57.34,118.24) 57.15,118.43 57.15,119.06 arc(56.96,119.25) 56.77,119.06 56.77,118.43 arc(56.58,118.24) 56.39,118.43 56.39,119.06 arc(56.2,119.25) 56.01,119.06 56.01,118.94 arc(55.95,118.8) 55.82,118.74 55.63,118.74 arc(55.49,118.8) 55.43,118.94 55.43,119.06 arc(55.24,119.25) 55.05,119.06 55.05,118.94 arc(55,118.8) 54.86,118.74 v2(54.1,118.74)
LCD-DATA10: length 32.3
  Top Layer w0.25: v2(53.59,114.05) 53.47,114.05 52.78,114.73 FPC5.14 ; v2(58.41,109.17) 58.8,108.78 58.8,107.44 arc(58.75,107.31) 58.61,107.25 58.48,107.25 arc(58.29,107.06) 58.48,106.87 59.12,106.87 arc(59.31,106.68) 59.12,106.49 58.48,106.49 arc(58.29,106.3) 58.48,106.11 59.12,106.11 arc(59.31,105.92) 59.12,105.73 58.48,105.73 arc(58.29,105.54) 58.48,105.35 59.12,105.35 arc(59.31,105.16) 59.12,104.97 58.48,104.97 arc(58.29,104.77) 58.48,104.58 59.12,104.58 arc(59.31,104.39) 59.12,104.2 58.48,104.2 arc(58.29,104.01) 58.48,103.82 59.12,103.82 arc(59.31,103.63) 59.12,103.44 58.48,103.44 arc(58.29,103.25) 58.48,103.06 59.12,103.06 arc(59.31,102.87) 59.12,102.68 58.99,102.68 arc(58.86,102.62) 58.8,102.49 58.8,100.67 57,98.87 57,98.27 56.98,98.25 56.98,97.81 U45.81
  Bottom Layer w0.25: v2(53.59,114.05) 58.41,109.23 v2(58.41,109.17)
LCD-DATA11: length 33.2
  Top Layer w0.25: FPC5.15 52.28,113.96 v2(52.35,113.89) ; U45.82 55.56,98.75 54.77,99.54 54,99.54 53.83,99.72 53.83,100.18 53.98,100.33 55.3,100.33 57.28,102.31 57.28,102.78 arc(57.22,102.91) 57.09,102.97 56.97,102.97 arc(56.78,103.16) 56.97,103.35 57.59,103.35 arc(57.78,103.54) 57.59,103.73 56.97,103.73 arc(56.78,103.92) 56.97,104.11 57.59,104.11 arc(57.78,104.3) 57.59,104.49 56.97,104.49 arc(56.78,104.68) 56.97,104.87 57.59,104.87 arc(57.78,105.06) 57.59,105.25 56.97,105.25 arc(56.78,105.44) 56.97,105.63 57.59,105.63 arc(57.78,105.82) 57.59,106.01 56.97,106.01 arc(56.78,106.2) 56.97,106.39 57.59,106.39 arc(57.78,106.59) 57.59,106.78 56.97,106.78 arc(56.78,106.97) 56.97,107.16 57.09,107.16 arc(57.22,107.21) 57.28,107.35 57.28,108.4 v2(57.15,108.53)
  Bottom Layer w0.25: v2(52.35,113.89) 52.35,113.33 v2(57.15,108.53)
LCD-DATA12: length 33.4
  Top Layer w0.25: 51.78,116.16 51.73,116.1 v2(51.73,113.28) ; v2(55.63,108.4) 55.63,107.71 arc(55.57,107.58) 55.44,107.52 55.32,107.52 arc(55.13,107.33) 55.32,107.14 55.94,107.14 arc(56.13,106.95) 55.94,106.76 55.32,106.76 arc(55.13,106.57) 55.32,106.38 55.94,106.38 arc(56.13,106.19) 55.94,106 55.32,106 arc(55.13,105.81) 55.32,105.61 55.94,105.61 arc(56.13,105.42) 55.94,105.23 55.32,105.23 arc(55.13,105.04) 55.32,104.85 55.94,104.85 arc(56.13,104.66) 55.94,104.47 55.32,104.47 arc(55.13,104.28) 55.32,104.09 55.94,104.09 arc(56.13,103.9) 55.94,103.71 55.32,103.71 arc(55.13,103.52) 55.32,103.33 55.94,103.33 arc(56.13,103.14) 55.94,102.95 55.82,102.95 arc(55.68,102.89) 55.63,102.76 55.63,101.73 54.61,100.71 53.21,100.71 52.83,100.33 52.83,99.69 53.34,99.19 53.98,99.19 54.56,98.6 U45.83
  Bottom Layer w0.25: v2(51.73,113.28) 51.73,112.23 55.55,108.4 v2(55.63,108.4)
LCD-DATA13: length 31.1
  Top Layer w0.25: U45.84 53.59,97.42 53.59,98.63 53.44,98.79 52.47,98.79 52.2,99.06 52.2,100.71 52.82,101.34 53.73,101.34 53.98,101.59 53.98,102.17 arc(54.03,102.3) 54.17,102.36 54.28,102.36 arc(54.48,102.55) 54.28,102.74 53.67,102.74 arc(53.48,102.93) 53.67,103.12 54.28,103.12 arc(54.48,103.31) 54.28,103.5 53.67,103.5 arc(53.48,103.69) 53.67,103.88 54.28,103.88 arc(54.48,104.07) 54.28,104.26 53.67,104.26 arc(53.48,104.45) 53.67,104.64 54.28,104.64 arc(54.48,104.83) 54.28,105.02 53.67,105.02 arc(53.48,105.21) 53.67,105.41 54.28,105.41 arc(54.48,105.6) 54.28,105.79 53.67,105.79 arc(53.48,105.98) 53.67,106.17 53.78,106.17 arc(53.92,106.22) 53.98,106.36 v2(53.98,108.62) ; v2(50.89,113.61) 51.27,113.99 51.27,116.15 FPC5.17
  Bottom Layer w0.25: v2(53.98,108.62) 53.98,108.84 50.55,112.27 50.55,113.26 v2(50.89,113.61)
LCD-DATA14: length 29.8
  Top Layer w0.25: v2(49.87,113.37) 49.87,113.62 50.78,114.54 FPC5.18 ; v2(53.21,108.15) 53.21,107.44 52.58,106.81 52.58,105.91 arc(52.63,105.78) 52.77,105.72 52.89,105.72 arc(53.08,105.53) 52.89,105.34 52.27,105.34 arc(52.08,105.15) 52.27,104.96 52.89,104.96 arc(53.08,104.77) 52.89,104.58 52.27,104.58 arc(52.08,104.39) 52.27,104.2 52.89,104.2 arc(53.08,104.01) 52.89,103.82 52.27,103.82 arc(52.08,103.62) 52.27,103.43 52.89,103.43 arc(53.08,103.24) 52.89,103.05 52.77,103.05 arc(52.63,103) 52.58,102.86 52.58,101.85 51.56,100.83 U45.86
  Bottom Layer w0.25: v2(49.87,113.37) 49.78,113.28 49.78,112.27 50.45,111.6 arc(50.51,111.46) 50.45,111.33 50.27,111.15 arc(50.27,110.88) 50.54,110.88 50.72,111.06 arc(50.86,111.12) 50.99,111.06 51.13,110.92 arc(51.18,110.79) 51.13,110.66 50.95,110.48 arc(50.95,110.21) 51.22,110.21 51.4,110.39 arc(51.53,110.44) 51.67,110.39 51.8,110.25 arc(51.86,110.12) 51.8,109.98 51.62,109.8 arc(51.62,109.53) 51.89,109.53 52.07,109.71 arc(52.2,109.77) 52.34,109.71 53.21,108.84 v2(53.21,108.15)
LCD-DATA15: length 29.3
  Top Layer w0.25: U45.87 50.56,98.92 50.53,98.95 arc(50.47,99.08) 50.53,99.22 50.61,99.3 arc(50.61,99.57) 50.34,99.57 49.9,99.13 arc(49.64,99.14) 49.64,99.4 49.72,99.49 arc(49.78,99.62) 49.72,99.76 49.15,100.33 49.15,100.81 49.56,101.22 51.29,101.22 51.69,101.62 51.69,106.68 52.45,107.44 v2(52.45,108.2) ; FPC5.19 50.28,115.43 49.78,114.93 49.01,114.93 v2(48.99,114.96)
  Bottom Layer w0.25: v2(52.45,108.2) 48.64,112.01 48.64,112.19 arc(48.59,112.33) 48.45,112.38 48.18,112.38 arc(47.99,112.57) 48.18,112.76 49.1,112.76 arc(49.3,112.95) 49.1,113.14 48.18,113.14 arc(47.99,113.33) 48.18,113.52 48.45,113.52 arc(48.59,113.58) 48.64,113.71 48.64,114.61 v2(48.99,114.96)
LCD-DATA16: length 32.2
  Top Layer w0.25: R127.1 70.23,117.6 71.12,118.49 71.12,120.14 70.1,121.16 69.63,121.16 arc(69.49,121.1) 69.44,120.97 69.44,120.84 arc(69.25,120.65) 69.06,120.84 69.06,121.48 arc(68.86,121.67) 68.67,121.48 68.67,120.84 arc(68.48,120.65) 68.29,120.84 68.29,121.48 arc(68.1,121.67) 67.91,121.48 67.91,120.84 arc(67.72,120.65) 67.53,120.84 67.53,121.48 arc(67.34,121.67) 67.15,121.48 67.15,120.84 arc(66.96,120.65) 66.77,120.84 66.77,121.48 arc(66.58,121.67) 66.39,121.48 66.39,120.84 arc(66.2,120.65) 66.01,120.84 66.01,121.48 arc(65.82,121.67) 65.63,121.48 65.63,120.84 arc(65.44,120.65) 65.25,120.84 65.25,120.97 arc(65.19,121.1) 65.05,121.16 64.26,121.16 63.12,120.01 63.12,116.59 61.34,114.81 58.55,114.81 58.28,115.07 58.28,116.16
LCD-DATA17: length 31.5
  Top Layer w0.25: FPC5.4 57.78,114.68 58.29,114.17 61.47,114.17 63.25,115.95 69.85,115.95 72.01,118.11 76.2,118.11 76.71,117.6 76.71,114.93 75.68,113.9 R126.1
LCD-DATA18: length 32.4
  Top Layer w0.25: FPC5.5 57.28,110.75 56.13,109.6 51.82,109.6 51.31,109.09 51.31,101.86 51.04,101.6 47.29,101.6 46.86,101.17 46.86,100.52 47.47,99.92 arc(47.6,99.86) 47.74,99.92 48.2,100.38 arc(48.47,100.38) 48.47,100.11 48.01,99.65 arc(47.95,99.51) 48.01,99.38 48.14,99.24 arc(48.28,99.19) 48.41,99.24 48.87,99.7 arc(49.14,99.7) 49.14,99.43 48.68,98.97 arc(48.63,98.84) 48.68,98.7 49.43,97.95 49.43,97.51 U45.88
LCD-DATA19: length 30.1
  Top Layer w0.25: 56.78,116.15 56.86,116.08 56.86,111.34 55.75,110.23 51.56,110.23 50.8,109.47 50.8,102.5 50.45,102.15 45.77,102.15 45.34,101.73 45.34,101.09 48.39,98.04 48.39,97.93 48.56,97.77 U45.89
LCD-DATA20: length 30.9
  Top Layer w0.25: FPC5.7 56.28,111.91 55.07,110.7 51.01,110.7 50.32,110.01 50.32,103.16 49.79,102.62 44.32,102.62 44.07,102.37 44.07,101.35 47.22,98.2 47.22,97.76 47.56,97.42 U45.90
LCD-DATA21: length 33.3
  Top Layer w0.25: FPC5.8 55.71,116.09 55.71,112.22 54.74,111.25 50.17,111.25 49.53,110.62 49.53,103.89 48.89,103.25 42.67,103.25 42.19,102.77 42.19,101.21 42.48,100.92 43.47,100.92 43.5,100.89 46.7,97.81 46.7,97.4 46.69,97.38 U45.91
LCD-DATA22: length 33.7
  Top Layer w0.25: U45.92 45.43,97.51 45.43,97.95 45.14,98.25 45.14,98.25 42.87,100.51 41.52,100.51 41.27,100.76 41.27,103.38 41.52,103.63 48.28,103.63 49.15,104.5 49.15,104.91 49.16,104.92 49.16,111.27 49.78,111.89 54.23,111.89 55.28,112.94 55.28,116.16
LCD-DATA23: length 33.6
  Top Layer w0.25: U45.93 44.6,97.43 44.6,97.78 42.34,100.04 40.92,100.04 40.67,100.29 40.67,103.91 40.92,104.16 48.23,104.16 48.8,104.73 48.8,105.06 48.81,105.07 48.81,111.48 49.81,112.48 53.69,112.48 54.71,113.5 54.71,116.08 FPC5.10
LCD-DE: length 33.4
  Top Layer w0.25: U45.95 42.56,98.16 41.78,98.93 38.99,98.93 38.1,99.82 38.1,107.78 arc(38.16,107.91) 38.29,107.97 38.8,107.97 arc(38.99,108.16) 38.8,108.35 37.4,108.35 arc(37.21,108.54) 37.4,108.73 38.8,108.73 arc(38.99,108.92) 38.8,109.11 37.4,109.11 arc(37.21,109.3) 37.4,109.49 38.8,109.49 arc(38.99,109.68) 38.8,109.87 38.29,109.87 arc(38.16,109.93) 38.1,110.06 38.1,112.01 38.99,112.9 40.89,112.9 43.28,115.29 FPC5.33
LCD-HSYNC: length 34
  Top Layer w0.25: U45.73 64.56,102.09 v2(59.97,106.68) ; v2(43.56,112.57) 43.56,113.28 44.34,114.06 44.34,116.1 FPC5.31
  Bottom Layer w0.25: v2(59.97,106.68) 49.46,106.68 v2(43.56,112.57)
LCD-VSYNC: length 33.8
  Top Layer w0.25: v2(60.6,107.31) 65.43,102.49 65.43,97.51 U45.72 ; FPC5.32 43.78,114.45 v2(43.64,114.3)
  Bottom Layer w0.25: v2(60.6,107.31) 50.62,107.31 v2(43.64,114.3)
LCD_RST: length 77.1
  Top Layer w0.25: v2(38.73,115.19) 38.81,115.19 FPC5.40 ; U45.40 66.56,65.33 v2(66.26,65.63)
  Bottom Layer w0.25: v2(38.73,115.19) 38.73,71.25 41.02,68.96 62.93,68.96 v2(66.26,65.63)
PWM3: length 77.4
  Top Layer w0.25: v2(67.31,66.17) 67.34,66.13 U45.41 ; FPC5.34 42.85,116.23 42.85,116.87 43.58,117.6 v2(44.58,117.6)
  Bottom Layer w0.25: v2(44.58,117.6) 44.58,116.2 43.69,115.32 43.69,115.18 42.98,114.47 42.98,112.33 43.69,111.62 43.69,80.26 46.23,77.72 64.9,77.72 65.66,76.96 65.66,67.82 v2(67.31,66.17)
PWR_ON: length 43.3
  Top Layer w0.6: U45.20 46.56,61.9 v1(47.24,61.21) ; v1(49.4,57.91) 49.4,55.94 49.37,55.91 R101.1 41.61,54.18 40.26,52.83 40.26,49.28 37.85,46.86 37.85,41.53 45,34.37 R105.1
  Bottom Layer w0.6: v1(49.4,57.91) 49.4,59.05 v1(47.24,61.21)
RESET: length 62.2
  Top Layer w0.25: U33.1 66.1,29.03 66.26,29.19
  Top Layer w0.5: 63.54,28.93 C109.1 63.54,21.3 64.75,20.09 SW13.1 ; v1(61.72,45.21) 61.72,31.88 63.44,30.16 U33.1
  Top Layer w0.6: U45.19 45.56,60.87 46.48,60.07 54.23,60.07 v1(63.63,50.67)
  Bottom Layer w0.6: v1(61.72,45.21) 61.72,46.61 63.63,48.51 v1(63.63,50.67)
RS485_1_A: length 22.8
  Top Layer w0.254: R120.1 96.39,81.96 96.41,81.98 ; R120.1 91.19,79.64 R119.2 ; R120.1 89.23,81.96 88.52,82.68 86.33,82.68 ; D13.2 96.41,81.98 ; 96.41,81.98 97.2,81.19 98.92,81.19 arc(99.06,81.14) 99.11,81 99.11,80.88 arc(99.3,80.69) 99.49,80.88 99.49,81.5 arc(99.68,81.69) 99.87,81.5 99.87,81.38 arc(99.93,81.25) 100.06,81.19 P1.1
RS485_1_B: length 22.9
  Top Layer w0.254: U43.7 86.35,83.96 R120.2 91.27,83.88 92.67,83.88 arc(92.8,83.94) 92.86,84.07 92.86,84.19 arc(93.05,84.38) 93.24,84.19 93.24,84.07 arc(93.29,83.94) 93.43,83.88 96.41,83.88 ; P1.2 102.58,87.88 97.03,87.88 96.28,87.14 R118.1 D13.1
SPI1-HOLD: length 26.9
  Top Layer w0.25: R133.1 18.08,107.26 R132.1 18.32,102.58 20.32,100.58 31.11,100.58 31.56,100.14 U45.106
UART0_RX: length 38.2
  Top Layer w0.254: v2(61.01,61.01) 60.28,61.01 59.56,61.73 U45.33 ; v2(92.46,61.05) 93.57,61.05 94.07,61.56 U35.2
  Bottom Layer w0.254: v2(92.46,61.05) 92.41,61.01 v2(61.01,61.01)
UART0_TX: length 38.2
  Top Layer w0.254: U35.3 94.99,62.88 93.36,62.88 92.58,62.1 v2(92.58,62.07) ; U45.34 60.56,62.5 61.21,61.85 61.72,61.85 v2(61.85,61.72)
  Bottom Layer w0.254: v2(61.85,61.72) 66.17,61.72 arc(66.26,61.68) 66.29,61.59 arc(66.33,61.51) 66.42,61.47 66.55,61.47 arc(66.64,61.51) 66.67,61.59 arc(66.71,61.68) 66.8,61.72 66.93,61.72 arc(67.02,61.68) 67.06,61.59 arc(67.09,61.51) 67.18,61.47 67.31,61.47 arc(67.4,61.51) 67.44,61.59 arc(67.47,61.68) 67.56,61.72 67.69,61.72 arc(67.78,61.68) 67.82,61.59 arc(67.85,61.51) 67.94,61.47 68.07,61.47 arc(68.16,61.51) 68.2,61.59 arc(68.24,61.68) 68.33,61.72 68.45,61.72 arc(68.54,61.68) 68.58,61.59 arc(68.62,61.51) 68.71,61.47 68.83,61.47 arc(68.92,61.51) 68.96,61.59 arc(69,61.68) 69.09,61.72 69.21,61.72 arc(69.3,61.68) 69.34,61.59 arc(69.38,61.51) 69.47,61.47 69.6,61.47 arc(69.69,61.51) 69.72,61.59 arc(69.76,61.68) 69.85,61.72 92.23,61.72 v2(92.58,62.07)
UART4_RX: length 23
  Top Layer w0.254: U45.48 68.83,73.15 v2(71.37,73.15) ; U43.1 v2(78.49,85.22)
  Bottom Layer w0.254: v2(78.49,85.22) 74.17,85.22 73.15,84.2 73.15,73.91 72.39,73.15 v2(71.37,73.15)
UART4_TX: length 23
  Top Layer w0.254: U45.49 69.06,74.13 69.19,74.01 72.8,74.01 74.3,72.52 75.15,72.52 arc(75.29,72.46) 75.35,72.33 75.35,72.2 arc(75.54,72.01) 75.73,72.2 75.73,72.33 arc(75.78,72.46) 75.92,72.52 80.98,72.52 81.62,73.15 U44.1 81.62,76.73 R117.1 80.8,77.55 U43.4
UART_3.3: length 16.8
  Top Layer w0.6: U36.2 85.32,63.12 86.61,63.12 88.17,61.56 U35.15 ; U36.2 81.02,61.77 C114.2 ; U36.2 83.95,61.81 C112.1 83.95,68.82 C113.1
USB0_N: length 25.6
  Top Layer w0.254: U38.1 12.88,81.86 ; 12.88,81.86 13.32,82.3 15.7,82.3 15.88,82.48 15.88,82.65 arc(15.82,82.79) 15.68,82.84 15.56,82.84 arc(15.37,83.03) 15.56,83.23 15.68,83.23 arc(15.88,83.42) 15.68,83.61 15.56,83.61 arc(15.37,83.8) 15.56,83.99 15.68,83.99 arc(15.82,84.04) 15.88,84.18 15.88,84.58 16.43,85.13 U45.121 ; 12.88,81.86 12.46,82.28 USBC8.B7 6.97,82.28 6.86,82.17 6.86,81.41 6.98,81.28 USBC8.A7
USB0_P: length 25.6
  Top Layer w0.254: 9.33,80.77 11.61,80.77 U46.1 12.82,79.44 12.82,78.73 13.08,78.48 16.25,78.48 17.27,79.5 17.27,83.57 17.84,84.13 U45.122 ; 9.33,80.77 9.52,80.97 9.52,81.53 9.35,81.71 8.26,81.71 USBC8.A6 ; 9.33,80.77 8.2,80.77 USBC8.B6
USB_ID: length 84.4
  Top Layer w0.25: v2(28.45,86.36) 59.44,86.36 61.56,84.24 U45.35 ; v2(19.81,86.36) D12.2 14.86,87.51 14.35,88.01 9.14,88.01 8.13,89.03 8.13,93.36 8.07,93.43 Q5.1 R111.2
  Bottom Layer w0.25: v2(19.81,86.36) v2(28.45,86.36)
VUSB: length 37.9
  Top Layer w0.4: USBC6.A4B9 101.07,62.48 101.72,62.48 102.26,63.03 103.16,63.03 103.53,63.4 103.53,66.65 103.25,66.93 102.62,66.93 102.61,66.92 101.9,66.92 101.7,67.13 101.21,67.13 101.19,67.15 USBC6.B4A9
  Top Layer w0.6: 85.57,56.56 85.57,58.33 84.93,58.96 U36.3 85.65,60.29 U35.16 89.39,60.2 90.45,60.2 91.44,61.19 91.44,66.42 92.93,67.91 U35.7 v1(96.65,67.91) ; 85.57,56.56 C116.2 ; 85.57,56.56 C115.2 ; USBC6.B4A9 100.89,67.2 100.1,67.2 99.35,67.94 v1(98.68,67.94)
  Bottom Layer w0.6: v1(96.65,67.91) 98.65,67.91 v1(98.68,67.94)
$4N231: length 8.5
  Top Layer w0.6: DC3.1 94.74,14.01 SW12.1
$4N235: length 7
  Top Layer w0.8: SW12.2 93.15,24.95 F1.1
$4N505: length 7.3
  Top Layer w0.6: U27.1 97.74,33.27 96.87,33.27 R91.1 R92.1
$4N519: length 24.2
  Top Layer w0.6: U28.1 96.27,44.09 C84.2 95.37,39.19 Q3.2 94.93,38.29 93.26,36.61 R92.2 90.51,36.61 87.99,34.09 ; F1.2 87.99,31.97 87.99,34.09 ; Q4.1 87.34,36.29 87.99,36.29 87.99,34.09
$4N670: length 14
  Top Layer w0.6: v1(97.15,40) 97.15,38.24 R91.2 ; v1(90.8,40.26) 90.8,39.24 91.3,38.75 Q3.1
  Bottom Layer w0.5: v1(97.15,40) 96.9,40.26 v1(90.8,40.26)
$4N708: length 11.8
  Top Layer w0.6: R93.1 91.06,49.87 R94.1 92.87,46.92 U28.2 93.37,46.68 C84.1 93.37,41.36 Q3.3
$4N1099: length 11.1
  Top Layer w0.5: 88.82,36.29 89.47,36.94 89.47,46.64 89.19,46.92 R94.2
$4N1635: length 3.5
  Top Layer w0.25: U29.5 30.61,38.22 30.61,39.5 31.56,40.45 R95.2
$4N1770: length 4.2
  Top Layer w0.25: C88.1 29.62,38 U29.6
$4N1775: length 9.6
  Top Layer w0.25: U29.2 30.61,35.63 30.61,33.78 30.09,33.27 L7.1 26.17,33.27 25.65,33.79 C88.2
$4N1855: length 7.6
  Top Layer w0.25: R97.2 R96.1 34.5,38.13 31.65,38.13
$4N2713: length 7.3
  Top Layer w0.6: R98.2 52.55,52.18 R101.2 50.01,51.55 U30.5
$4N2715: length 11.8
  Top Layer w0.6: L8.1 44.93,42.51 C93.2 47.2,44.07 49.5,44.07 50.01,44.58 U30.2
$4N2720: length 4.2
  Top Layer w0.6: U30.6 48.86,48.34 C93.1
$4N2723: length 8.3
  Top Layer w0.6: R100.2 59.02,48.47 R99.1 54.38,48.54 50.96,48.54
$4N3207: length 9.5
  Top Layer w0.25: C98.2 37.18,25.15 38.23,24.1 L9.1 41.37,24.99 U31.2
$4N3212: length 7.7
  Top Layer w0.25: 42.32,29.62 45.06,29.62 R103.1 49.91,29.38 R104.2
$4N3243: length 3.3
  Top Layer w0.25: U31.6 40.22,29.42 C98.1
$4N3246: length 6.3
  Top Layer w0.25: U31.5 41.27,29.72 41.27,30.86 42.02,31.61 R102.2 45.2,32.26 R105.2
$4N4522: length 2.9
  Top Layer w0.6: LED4.2 24.94,49.15 R109.2
$5N1142: length 8.5
  Top Layer w0.25: U35.4 96.04,64.1 96.65,63.5 96.65,58.09 C111.2
$5N3847: length 7.5
  Top Layer w0.25: 12.24,95.87 U37.4 ; 12.24,95.87 Q5.3 ; 12.24,95.87 12.24,99.28 11.81,99.71
$5N4121: length 3.7
  Top Layer w0.25: R112.1 18.59,95.69 U37.3
$5N5803: length 6.4
  Top Layer w0.25: U41.2 77.29,98.62 X2.1 76.6,97.64 C121.2
$5N5809: length 6.7
  Top Layer w0.25: U41.1 78.2,100.33 X2.2 76.66,100.54 C120.2
$5N5973: length 8.5
  Top Layer w0.25: U42.3 87.61,96.99 C122.1 84.2,100.46 83.55,99.81 U41.8
$5N6294: length 3.7
  Top Layer w0.25: R115.2 11.59,115.44 LED5.2
$5N6323: length 3
  Top Layer w0.25: LED5.1 16.3,115.77 Q7.3
$5N6452: length 7.3
  Top Layer w0.25: 76.45,82.4 76.58,82.52 R116.1 80.62,84.12 U43.2 80.8,82.68
$5N6688: length 10.1
  Top Layer w0.25: Q6.1 75.53,80.39 C123.2 75.55,77.47 R117.2 78.74,77.33 78.74,74.25 U44.2
$5N10229: length 5.7
  Top Layer w0.25: Q7.1 18.43,109.14 R132.2
$5N12236: length 6.8
  Top Layer w0.25: R134.2 98.17,59.05 98.17,62.74 98.93,63.5 USBC6.A5
$5N12273: length 6.5
  Top Layer w0.25: USBC6.B5 98.47,66.5 97.73,67.25 R135.2
$5N12607: length 13.7
  Top Layer w0.25: USBC8.B5 7.46,79.78 6.1,81.15 6.1,82.3 6.58,82.78 USBC8.A5 11.79,82.78 12.63,83.62 U40.2 12.63,86.18 12.45,86.36

## Copper pours and planes (outline as drawn; the poured copper is in the pictures)
